# Altium project acquisition board.PRJPCB
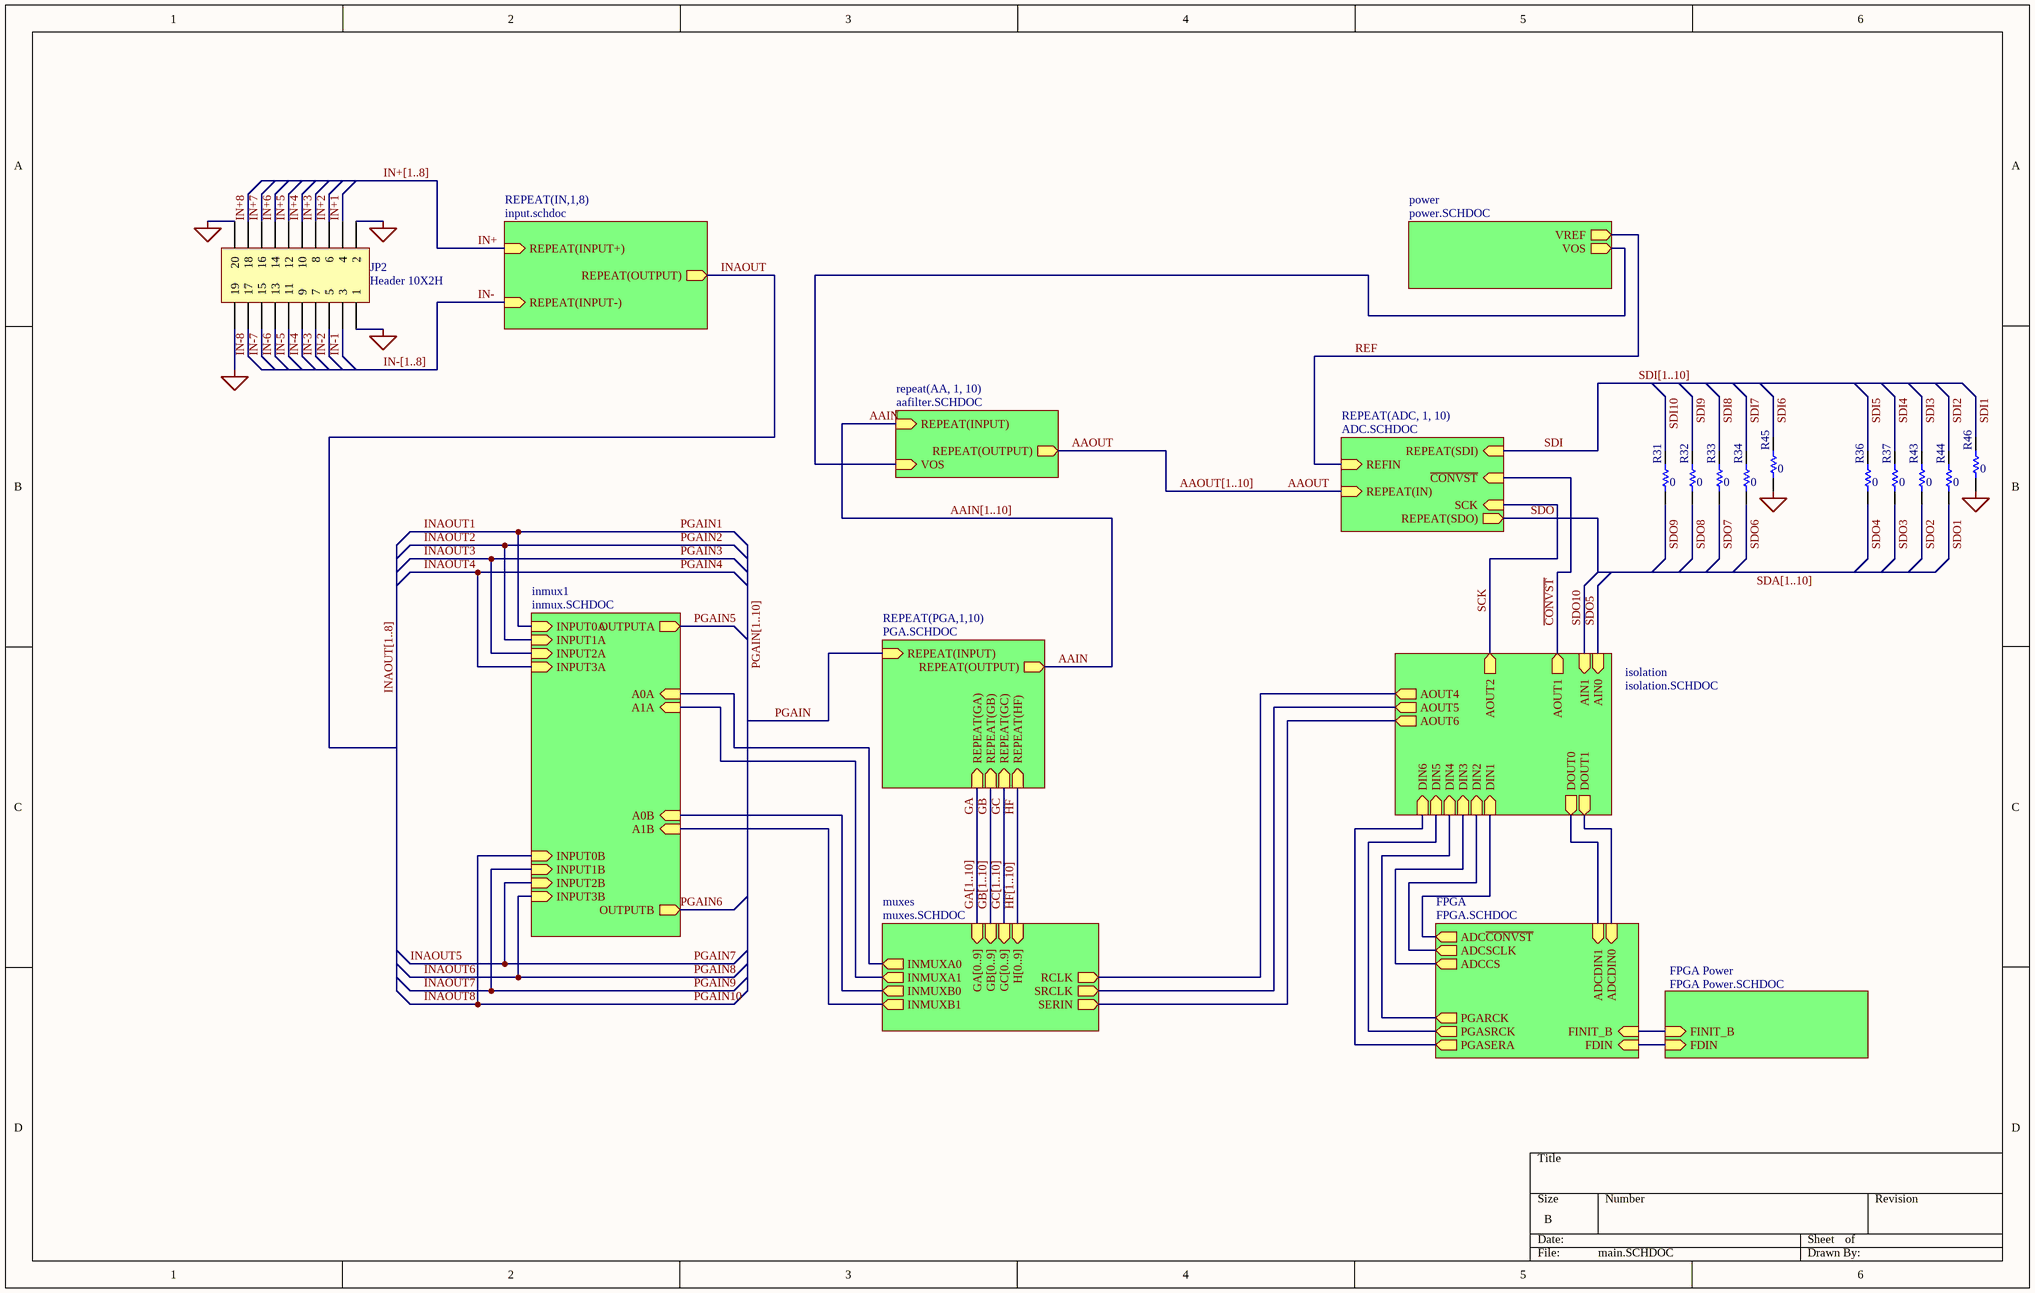
[diagram p0: main.SCHDOC]
11 sheets, 570 parts. Net scope: hierarchical (ports join the sheet entries above them; power ports are global).
Board file: acqboard.PcbDoc
Sheets:
  main.SCHDOC
    IN1 = input.SCHDOC
    IN2 = input.SCHDOC
    IN3 = input.SCHDOC
    IN4 = input.SCHDOC
    IN5 = input.SCHDOC
    IN6 = input.SCHDOC
    IN7 = input.SCHDOC
    IN8 = input.SCHDOC
    AA1 = aafilter.SCHDOC
    AA2 = aafilter.SCHDOC
    AA3 = aafilter.SCHDOC
    AA4 = aafilter.SCHDOC
    AA5 = aafilter.SCHDOC
    AA6 = aafilter.SCHDOC
    AA7 = aafilter.SCHDOC
    AA8 = aafilter.SCHDOC
    AA9 = aafilter.SCHDOC
    AA10 = aafilter.SCHDOC
    inmux1 = inmux.SCHDOC
    PGA1 = PGA.SCHDOC
    PGA2 = PGA.SCHDOC
    PGA3 = PGA.SCHDOC
    PGA4 = PGA.SCHDOC
    PGA5 = PGA.SCHDOC
    PGA6 = PGA.SCHDOC
    PGA7 = PGA.SCHDOC
    PGA8 = PGA.SCHDOC
    PGA9 = PGA.SCHDOC
    PGA10 = PGA.SCHDOC
    isolation = isolation.SCHDOC
    power = power.SCHDOC
    FPGA = FPGA.SCHDOC
    muxes = muxes.SCHDOC
    FPGA Power = FPGA Power.SCHDOC
    ADC1 = ADC.SCHDOC
    ADC2 = ADC.SCHDOC
    ADC3 = ADC.SCHDOC
    ADC4 = ADC.SCHDOC
    ADC5 = ADC.SCHDOC
    ADC6 = ADC.SCHDOC
    ADC7 = ADC.SCHDOC
    ADC8 = ADC.SCHDOC
    ADC9 = ADC.SCHDOC
    ADC10 = ADC.SCHDOC

## Sheet main.SCHDOC
size B

### Parts
JP2  Header 10X2H  [HDR2X10]
R31  value 0  [0603]  (hidden comment: Res1)
R32  value 0  [0603]  (hidden comment: Res1)
R33  value 0  [0603]  (hidden comment: Res1)
R34  value 0  [0603]  (hidden comment: Res1)
R36  value 0  [0603]  (hidden comment: Res1)
R37  value 0  [0603]  (hidden comment: Res1)
R43  value 0  [0603]  (hidden comment: Res1)
R44  value 0  [0603]  (hidden comment: Res1)
R45  value 0  [0603]  (hidden comment: Res1)
R46  value 0  [0603]  (hidden comment: Res1)

### Sub-sheets
FPGA = FPGA.SCHDOC: ADCDIN0 (in), ADCDIN1 (in), ADCSCLK (out), ADCCS (out), ADC~{CONVST} (out), PGARCK (out), PGASRCK (out), PGASERA (out), FINIT_B (in), FDIN (in)
FPGA Power = FPGA Power.SCHDOC: FINIT_B (in), FDIN (in)
inmux1 = inmux.SCHDOC: INPUT0A (in), INPUT1A (in), INPUT2A (in), INPUT3A (in), A0A (in), A1A (in), OUTPUTA (out), INPUT0B (in), INPUT1B (in), INPUT2B (in), INPUT3B, A0B (in), A1B (in), OUTPUTB (out)
isolation = isolation.SCHDOC: AIN1 (in), AIN0 (in), DOUT1 (out), DOUT0 (out), AOUT1 (out), AOUT2 (out), AOUT4, AOUT5 (out), AOUT6 (out), DIN1 (in), DIN2 (in), DIN3 (in), DIN4 (in), DIN5 (in), DIN6 (in)
muxes = muxes.SCHDOC: RCLK (out), SRCLK (out), SERIN (out), INMUXA0 (out), INMUXA1 (out), INMUXB0 (out), INMUXB1 (out), H[0..9] (in), GA[0..9] (in), GB[0..9] (in), GC[0..9] (in)
power = power.SCHDOC: VREF (out), VOS (out)
repeat(AA, 1, 10) = aafilter.SCHDOC: REPEAT(OUTPUT) (out), REPEAT(INPUT) (in), VOS (in)
REPEAT(ADC, 1, 10) = ADC.SCHDOC: REFIN (in), REPEAT(IN) (in), ~{CONVST} (in), SCK (in), REPEAT(SDO) (out), REPEAT(SDI) (in)
REPEAT(IN,1,8) = input.schdoc: REPEAT(INPUT+) (in), REPEAT(INPUT-) (in), REPEAT(OUTPUT) (out)
REPEAT(PGA,1,10) = PGA.SCHDOC: REPEAT(OUTPUT) (out), REPEAT(INPUT) (in), REPEAT(HF) (in), REPEAT(GA) (in), REPEAT(GB) (in), REPEAT(GC) (in)

### Nets
AGND: JP2.1 JP2.2 JP2.19 JP2.20 R45.1 R46.1
AAIN: sheet repeat(AA, 1, 10)/REPEAT(INPUT), sheet REPEAT(PGA,1,10)/REPEAT(OUTPUT)
AAOUT: sheet repeat(AA, 1, 10)/REPEAT(OUTPUT), sheet REPEAT(ADC, 1, 10)/REPEAT(IN)
~{CONVST}: sheet isolation/AOUT1, sheet REPEAT(ADC, 1, 10)/~{CONVST}
FDIN: sheet FPGA/FDIN, sheet FPGA Power/FDIN
FINIT_B: sheet FPGA/FINIT_B, sheet FPGA Power/FINIT_B
GA: sheet REPEAT(PGA,1,10)/REPEAT(GA)
GB: sheet REPEAT(PGA,1,10)/REPEAT(GB)
GC: sheet REPEAT(PGA,1,10)/REPEAT(GC)
HF: sheet REPEAT(PGA,1,10)/REPEAT(HF)
IN+: sheet REPEAT(IN,1,8)/REPEAT(INPUT+)
IN+1: JP2.4
IN+2: JP2.6
IN+3: JP2.8
IN+4: JP2.10
IN+5: JP2.12
IN+6: JP2.14
IN+7: JP2.16
IN+8: JP2.18
IN-: sheet REPEAT(IN,1,8)/REPEAT(INPUT-)
IN-1: JP2.3
IN-2: JP2.5
IN-3: JP2.7
IN-4: JP2.9
IN-5: JP2.11
IN-6: JP2.13
IN-7: JP2.15
IN-8: JP2.17
INAOUT: sheet REPEAT(IN,1,8)/REPEAT(OUTPUT)
PGAIN: sheet REPEAT(PGA,1,10)/REPEAT(INPUT)
RCLK: sheet isolation/AOUT4, sheet muxes/RCLK
REF: sheet power/VREF, sheet REPEAT(ADC, 1, 10)/REFIN
SCK: sheet isolation/AOUT2, sheet REPEAT(ADC, 1, 10)/SCK
SDI: sheet REPEAT(ADC, 1, 10)/REPEAT(SDI)
SDI1: R46.2
SDI2: R44.2
SDI3: R43.2
SDI4: R37.2
SDI5: R36.2
SDI6: R45.2
SDI7: R34.2
SDI8: R33.2
SDI9: R32.2
SDI10: R31.2
SDO: sheet REPEAT(ADC, 1, 10)/REPEAT(SDO)
SDO1: R44.1
SDO2: R43.1
SDO3: R37.1
SDO4: R36.1
SDO6: R34.1
SDO7: R33.1
SDO8: R32.1
SDO9: R31.1
SRCLK: sheet isolation/AOUT5, sheet muxes/SRCLK
NetU4_1: sheet isolation/DIN6, sheet FPGA/PGASERA
NetU4_2: sheet isolation/DIN5, sheet FPGA/PGASRCK
NetU4_5: sheet isolation/DIN4, sheet FPGA/PGARCK
NetU4_9: sheet isolation/DIN3, sheet FPGA/ADCCS
NetU4_71: sheet isolation/DOUT0, sheet FPGA/ADCDIN1
NetU4_72: sheet isolation/DOUT1, sheet FPGA/ADCDIN0
NetU4_89: sheet isolation/DIN1, sheet FPGA/ADC~{CONVST}
NetU4_91: sheet isolation/DIN2, sheet FPGA/ADCSCLK
NetU10.1_5: sheet repeat(AA, 1, 10)/VOS, sheet power/VOS
Netu11_1: sheet inmux1/A0A, sheet muxes/INMUXA0
Netu11_14: sheet inmux1/A1A, sheet muxes/INMUXA1
NetU14_11: sheet isolation/AOUT6, sheet muxes/SERIN
NetU21_4: sheet inmux1/A0B, sheet muxes/INMUXB0
NetU21_5: sheet inmux1/A1B, sheet muxes/INMUXB1

### Buses and harness runs
bus AAIN[1..10]
bus AAOUT[1..10]
bus GA[1..10] = sheet muxes/GA[0..9]
bus GB[1..10] = sheet muxes/GB[0..9]
bus GC[1..10] = sheet muxes/GC[0..9]
bus HF[1..10] = sheet muxes/H[0..9]
bus IN+[1..8]
bus IN-[1..8]
bus INAOUT[1..8]
bus PGAIN[1..10]
bus SDA[1..10]
bus SDI[1..10]

### Library data of the parts
JP2 = Header 10X2H: Header, 10-Pin, Dual row, Right Angle; Manufacturer: Generic Components; Class I: Connector; Revision: July-2002: Re-released for DXP Platform.; Publisher: Altium Limited
R31-R34 R36 R37 R43-R46 = Res1: Resistor; Published: 8-Jun-2000; LatestRevisionDate: 17-Jul-2002; LatestRevisionNote: Re-released for DXP Platform.; Publisher: Altium Limited

## Sheet input.SCHDOC
size B
Used 8 times, as channels IN1, IN2, IN3, IN4, IN5, IN6, IN7, IN8. Parts and nets are listed once, with the designators drawn on the sheet.
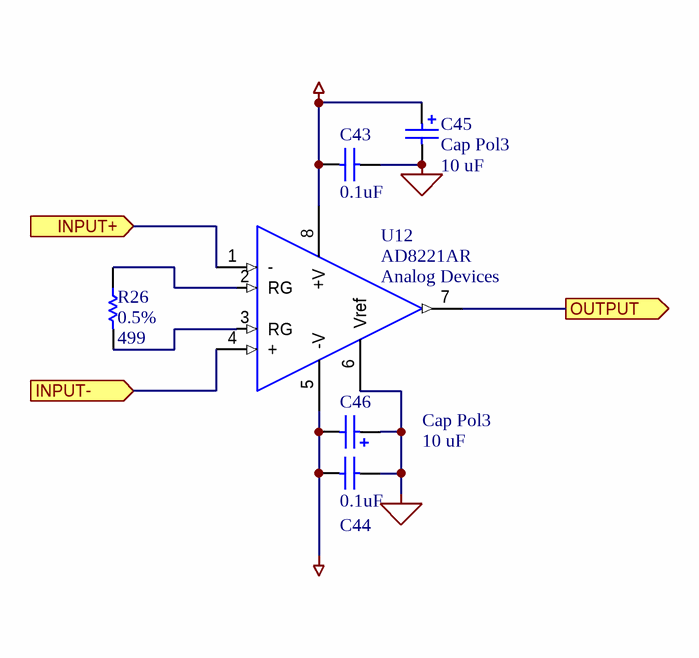
[diagram p1: input.SCHDOC]

### Parts
C43  value 0.1uF  [CC1608-0603]  (hidden comment: Cap)
C44  value 0.1uF  [CC1608-0603]  (hidden comment: Cap)
C45  Cap Pol3  value 10 uF  [TC3216-1206]
C46  Cap Pol3  value 10 uF  [TC3216-1206]
R26  0.5%  value 499  [CC1608-0603]
U12  AD8221AR  Vendor: Analog Devices  [SO-G8]

### Ports
INPUT+ (in), INPUT- (in), OUTPUT (out)

### Nets
AGND: C43.2 C44.2 C45.2 C46.1 U12.6(Vref)
AVDD: C43.1 C45.1 U12.8(+V)
AVSS: C44.1 C46.2 U12.5(-V)
INPUT+: U12.1(-) ; port INPUT+
INPUT-: U12.4(+) ; port INPUT-
OUTPUT: U12.7(Vout) ; port OUTPUT
NetR26_1: R26.1 U12.2(RG)
NetR26_2: R26.2 U12.3(RG)

### Channels
IN1: designators end in .1; ports INPUT+=IN+1 INPUT-=IN-1 OUTPUT=INAOUT1
IN2: designators end in .2; ports INPUT+=IN+2 INPUT-=IN-2 OUTPUT=INAOUT2
IN3: designators end in .3; ports INPUT+=IN+3 INPUT-=IN-3 OUTPUT=INAOUT3
IN4: designators end in .4; ports INPUT+=IN+4 INPUT-=IN-4 OUTPUT=INAOUT4
IN5: designators end in .5; ports INPUT+=IN+5 INPUT-=IN-5 OUTPUT=INAOUT5
IN6: designators end in .6; ports INPUT+=IN+6 INPUT-=IN-6 OUTPUT=INAOUT6
IN7: designators end in .7; ports INPUT+=IN+7 INPUT-=IN-7 OUTPUT=INAOUT7
IN8: designators end in .8; ports INPUT+=IN+8 INPUT-=IN-8 OUTPUT=INAOUT8

### Library data of the parts
C43 C44 = Cap: Capacitor; Manufacturer: Generic Components; Class I: Passive; Published: 8-Jun-2000; Revision: July-2002: Re-released for DXP Platform.; Publisher: Altium Limited; Class II: Capacitor
C45 C46 = Cap Pol3: Polarized Capacitor (Surface Mount); Manufacturer: Generic Components; Class I: Passive; Published: 8-Jun-2000; Revision: July-2002: Re-released for DXP Platform.; Publisher: Altium Limited; Class II: Capacitor
R26 = Res1: RR1220P-4990-D-M; Manufacturer: Generic Components; Class I: Passive; Class II: Resistor; Published: 8-Jun-2000; Revision: July-2002: Re-released for DXP Platform.; Publisher: Altium Limited
U12 = AD8221: AD8221 Precision Instrumentation Amplifier

## Sheet aafilter.SCHDOC
size B
Used 10 times, as channels AA1, AA2, AA3, AA4, AA5, AA6, AA7, AA8, AA9, AA10. Parts and nets are listed once, with the designators drawn on the sheet.
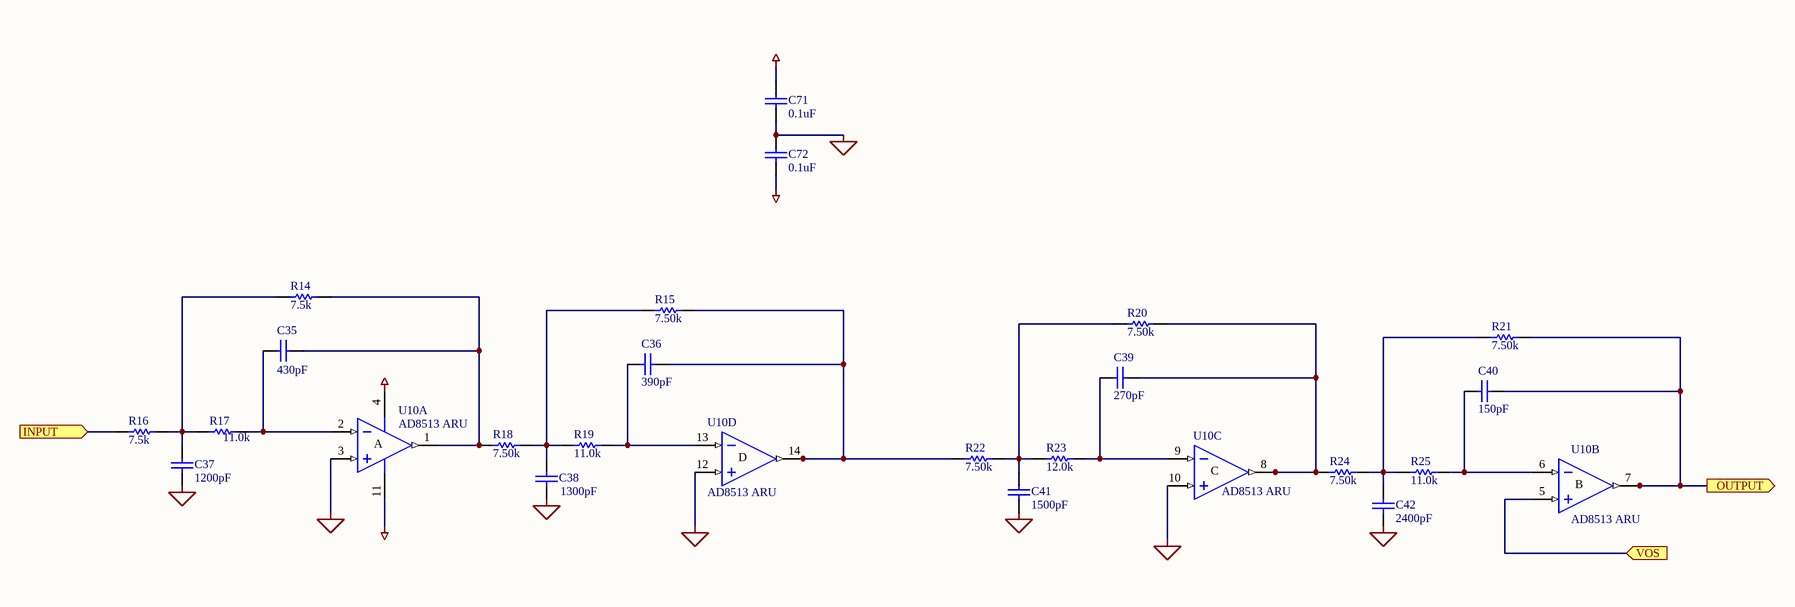
[diagram p2: aafilter.SCHDOC]

### Parts
C35  value 430pF  [CC1608-0603]  (hidden comment: Cap)
C36  value 390pF  [CC1608-0603]  (hidden comment: Cap)
C37  value 1200pF  [CC1608-0603]  (hidden comment: Cap)
C38  value 1300pF  [CC1608-0603]  (hidden comment: Cap)
C39  value 270pF  [CC1608-0603]  (hidden comment: Cap)
C40  value 150pF  [CC1608-0603]  (hidden comment: Cap)
C41  value 1500pF  [CC1608-0603]  (hidden comment: Cap)
C42  value 2400pF  [CC1608-0603]  (hidden comment: Cap)
C71  value 0.1uF  [CC1608-0603]  (hidden comment: Cap)
C72  value 0.1uF  [CC1608-0603]  (hidden comment: Cap)
R14  value 7.5k  [CC1608-0603]  (hidden comment: Res1)
R15  value 7.50k  [CC1608-0603]  (hidden comment: Res1)
R16  value 7.5k  [CC1608-0603]  (hidden comment: Res1)
R17  value 11.0k  [CC1608-0603]  (hidden comment: Res1)
R18  value 7.50k  [CC1608-0603]  (hidden comment: Res1)
R19  value 11.0k  [CC1608-0603]  (hidden comment: Res1)
R20  value 7.50k  [CC1608-0603]  (hidden comment: Res1)
R21  value 7.50k  [CC1608-0603]  (hidden comment: Res1)
R22  value 7.50k  [CC1608-0603]  (hidden comment: Res1)
R23  value 12.0k  [CC1608-0603]  (hidden comment: Res1)
R24  value 7.50k  [CC1608-0603]  (hidden comment: Res1)
R25  value 11.0k  [CC1608-0603]  (hidden comment: Res1)
U10  AD8513 ARU  [SO-G14]  (parts A,B,C,D of 4)

### Ports
INPUT (in), OUTPUT (out), VOS (in)

### Nets
AGND: C37.1 C38.1 C41.1 C42.1 C71.1 C72.2 U10.3(IN+A) U10.10(IN+C) U10.12(IN+D)
AVDD: C71.2 U10.4(V+)
AVSS: C72.1 U10.11(V-)
INPUT: R16.1 ; port INPUT
OUTPUT: C40.1 R21.1 U10.7(OUTB) ; port OUTPUT
VOS: U10.5(IN+B) ; port VOS
NetC35_1: C35.1 R14.1 R18.1 U10.1(OUTA)
NetC35_2: C35.2 R17.2 U10.2(IN-A)
NetC36_1: C36.1 R15.1 R22.1 U10.14(OUTD)
NetC36_2: C36.2 R19.2 U10.13(IN-D)
NetC37_2: C37.2 R14.2 R16.2 R17.1
NetC38_2: C38.2 R15.2 R18.2 R19.1
NetC39_1: C39.1 R20.1 R24.1 U10.8(OUTC)
NetC39_2: C39.2 R23.2 U10.9(IN-C)
NetC40_2: C40.2 R25.2 U10.6(IN-B)
NetC41_2: C41.2 R20.2 R22.2 R23.1
NetC42_2: C42.2 R21.2 R24.2 R25.1

### Channels
AA1: designators end in .1; ports INPUT=AAIN1 OUTPUT=AAOUT1 VOS=NetU10.1_5
AA2: designators end in .2; ports INPUT=AAIN2 OUTPUT=AAOUT2 VOS=NetU10.1_5
AA3: designators end in .3; ports INPUT=AAIN3 OUTPUT=AAOUT3 VOS=NetU10.1_5
AA4: designators end in .4; ports INPUT=AAIN4 OUTPUT=AAOUT4 VOS=NetU10.1_5
AA5: designators end in .5; ports INPUT=AAIN5 OUTPUT=AAOUT5 VOS=NetU10.1_5
AA6: designators end in .6; ports INPUT=AAIN6 OUTPUT=AAOUT6 VOS=NetU10.1_5
AA7: designators end in .7; ports INPUT=AAIN7 OUTPUT=AAOUT7 VOS=NetU10.1_5
AA8: designators end in .8; ports INPUT=AAIN8 OUTPUT=AAOUT8 VOS=NetU10.1_5
AA9: designators end in .9; ports INPUT=AAIN9 OUTPUT=AAOUT9 VOS=NetU10.1_5
AA10: designators end in .10; ports INPUT=AAIN10 OUTPUT=AAOUT10 VOS=NetU10.1_5

### Notes on the sheet
- (in symbol AD8513ARU, part A) A
- (in symbol AD8513ARU, part B) B
- (in symbol AD8513ARU, part C) C
- (in symbol AD8513ARU, part D) D

### Library data of the parts
C35-C42 C71 C72 = Cap: as C43 on sheet input; Published: 8-Jun-2000; Revision: July-2002: Re-released for DXP Platform.; Publisher: Altium Limited; Class II: Capacitor
R14-R25 = Res1: Resistor; Manufacturer: Generic Components; Class I: Passive; Published: 8-Jun-2000; Revision: July-2002: Re-released for DXP Platform.; Publisher: Altium Limited; Class II: Resistor
U10 = AD8513ARU: low-noise JFET quad OA; Vendor: Analog Devices

## Sheet inmux.SCHDOC
size A
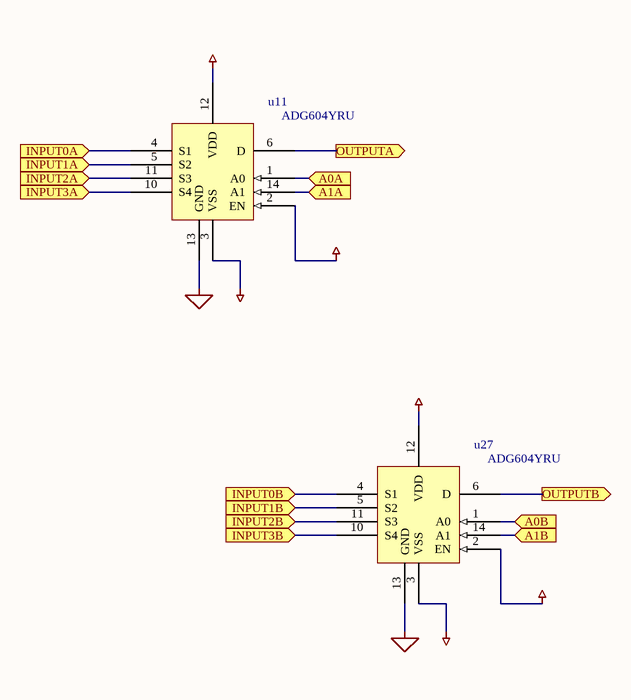
[diagram p3: inmux.SCHDOC]

### Parts
u11  ADG604YRU  [SSO-G14/X.4]
u27  ADG604YRU  [SSO-G14/X.4]

### Ports
A0A (in), A0B (in), A1A (in), A1B (in), INPUT0A (in), INPUT0B (in), INPUT1A (in), INPUT1B (in), INPUT2A (in), INPUT2B (in), INPUT3A (in), INPUT3B (in), OUTPUTA (out), OUTPUTB (out)

### Nets
AGND: u11.13(GND) u27.13(GND)
AVDD: u11.2(EN) u11.12(VDD) u27.2(EN) u27.12(VDD)
AVSS: u11.3(VSS) u27.3(VSS)
INAOUT1: u11.4(S1) ; port INPUT0A
INAOUT2: u11.5(S2) ; port INPUT1A
INAOUT3: u11.11(S3) ; port INPUT2A
INAOUT4: u11.10(S4) ; port INPUT3A
INAOUT5: u27.11(S3) ; port INPUT2B
INAOUT6: u27.10(S4) ; port INPUT3B
INAOUT7: u27.5(S2) ; port INPUT1B
INAOUT8: u27.4(S1) ; port INPUT0B
PGAIN5: u11.6(D) ; port OUTPUTA
PGAIN6: u27.6(D) ; port OUTPUTB
Netu11_1: u11.1(A0) ; port A0A
Netu11_14: u11.14(A1) ; port A1A
NetU21_4: u27.1(A0) ; port A0B
NetU21_5: u27.14(A1) ; port A1B

### Library data of the parts
u11 u27 = ADG604: 1 pC Charge Injection 100pA leakage CMOS 4-channel mux

## Sheet PGA.SCHDOC
size B
Used 10 times, as channels PGA1, PGA2, PGA3, PGA4, PGA5, PGA6, PGA7, PGA8, PGA9, PGA10. Parts and nets are listed once, with the designators drawn on the sheet.
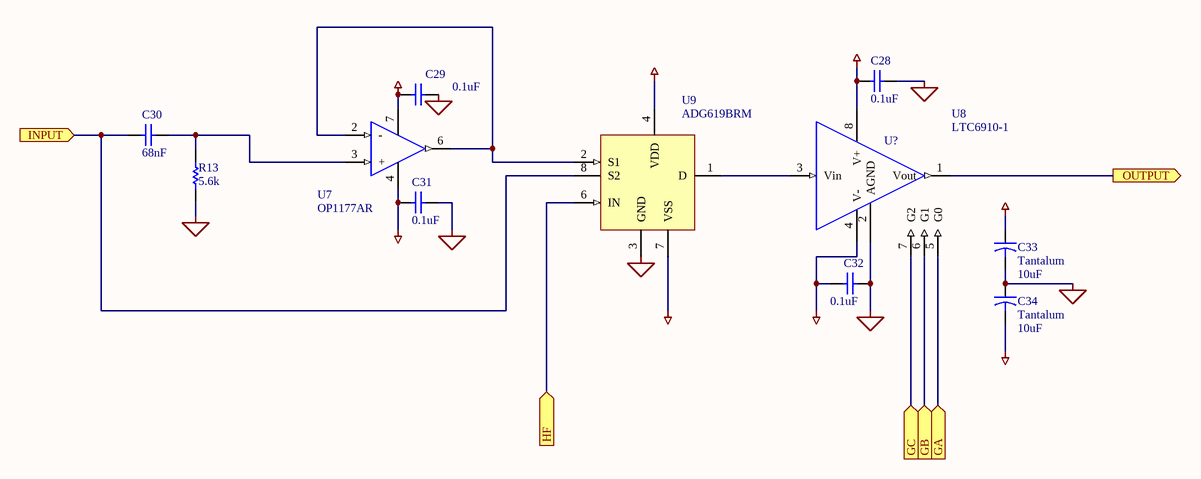
[diagram p4: PGA.SCHDOC]

### Parts
C28  value 0.1uF  [CC1608-0603]  (hidden comment: Cap)
C29  value 0.1uF  [CC1608-0603]  (hidden comment: Cap)
C30  value 68nF  [CC1608-0603]  (hidden comment: Cap)
C31  value 0.1uF  [CC1608-0603]  (hidden comment: Cap)
C32  value 0.1uF  [CC1608-0603]  (hidden comment: Cap)
C33  Tantalum  value 10uF  [TC3216-1206]
C34  Tantalum  value 10uF  [TC3216-1206]
R13  value 5.6k  [CC1608-0603]  (hidden comment: Res1)
U7  OP1177AR  [TSSO3X5-G8/X.4]
U8  LTC6910-1  [TSOT-23-8]
U9  ADG619BRM  [MSOP8]

### Ports
GA (in), GB (in), GC (in), HF (in), INPUT (in), OUTPUT (out)

### Nets
AGND: C28.2 C29.2 C31.2 C32.1 C33.2 C34.1 R13.1 U8.2(AGND) U9.3(GND)
AVDD: C28.1 C29.1 C33.1 U7.7(+Vs) U8.8(V+) U9.4(VDD)
AVSS: C31.1 C32.2 C34.2 U7.4(-Vs) U8.4(V-) U9.7(VSS)
GA: U8.5(G0) ; port GA
GB: U8.6(G1) ; port GB
GC: U8.7(G2) ; port GC
HF: U9.6(IN) ; port HF
INPUT: C30.2 U9.8(S2) ; port INPUT
OUTPUT: U8.1(Vout) ; port OUTPUT
NetC30_1: C30.1 R13.2 U7.3(+)
NetU7_2: U7.2(-) U7.6(Out) U9.2(S1)
NetU8_3: U8.3(Vin) U9.1(D)

### Channels
PGA1: designators end in .1; ports GA=GA0 GB=GB0 GC=GC0 HF=H0 INPUT=INAOUT1 OUTPUT=AAIN1
PGA2: designators end in .2; ports GA=GA1 GB=GB1 GC=GC1 HF=H1 INPUT=INAOUT2 OUTPUT=AAIN2
PGA3: designators end in .3; ports GA=GA2 GB=GB2 GC=GC2 HF=H2 INPUT=INAOUT3 OUTPUT=AAIN3
PGA4: designators end in .4; ports GA=GA3 GB=GB3 GC=GC3 HF=H3 INPUT=INAOUT4 OUTPUT=AAIN4
PGA5: designators end in .5; ports GA=GA4 GB=GB4 GC=GC4 HF=H4 INPUT=PGAIN5 OUTPUT=AAIN5
PGA6: designators end in .6; ports GA=GA5 GB=GB5 GC=GC5 HF=H5 INPUT=PGAIN6 OUTPUT=AAIN6
PGA7: designators end in .7; ports GA=GA6 GB=GB6 GC=GC6 HF=H6 INPUT=INAOUT5 OUTPUT=AAIN7
PGA8: designators end in .8; ports GA=GA7 GB=GB7 GC=GC7 HF=H7 INPUT=INAOUT6 OUTPUT=AAIN8
PGA9: designators end in .9; ports GA=GA8 GB=GB8 GC=GC8 HF=H8 INPUT=INAOUT7 OUTPUT=AAIN9
PGA10: designators end in .10; ports GA=GA10 GB=GB10 GC=GC10 HF=H9 INPUT=INAOUT8 OUTPUT=AAIN10

### Notes on the sheet
- (in symbol LTC6910-1) U?

### Library data of the parts
C28-C32 = Cap: as C43 on sheet input; Published: 8-Jun-2000; Revision: July-2002: Re-released for DXP Platform.; Publisher: Altium Limited; Class II: Capacitor
C33 C34 = Cap2: Capacitor; Manufacturer: Generic Components; Class I: Passive; Published: 23-Sep-2002; Publisher: Altium Limited; Class II: Capacitor
R13 = Res1: as R14 on sheet aafilter; Published: 8-Jun-2000; Revision: July-2002: Re-released for DXP Platform.; Publisher: Altium Limited; Class II: Resistor
U7 = OP1177: Precision Low Noise, Low Input Bias Current Operational Amplifier; Vendor: Analog Devices
U8 = LTC6910-1: LTI Digitally Controlled Programmabe Gain Amp; Vendor: Linear Technology
U9 = ADG619: Low RON SPDT Switch (s2 normally on); Vendors: Analog Devices

## Sheet isolation.SCHDOC
size B
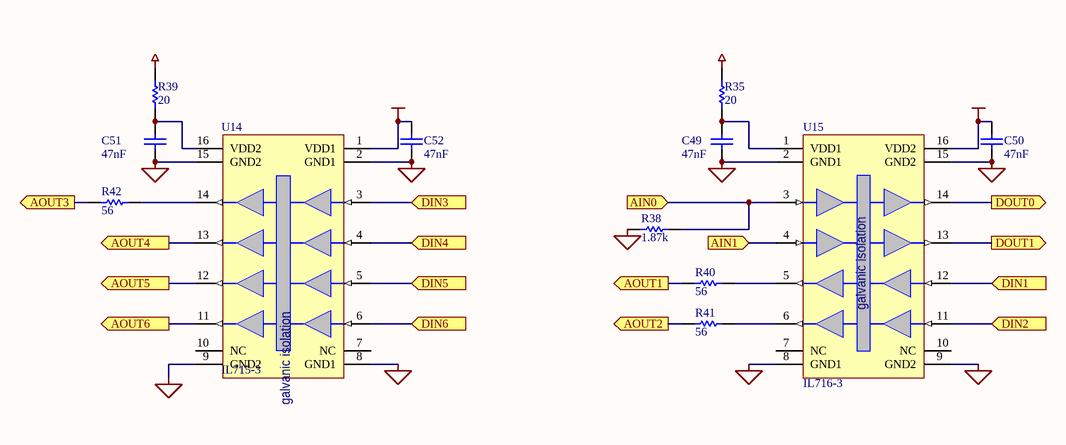
[diagram p5: isolation.SCHDOC]

### Parts
C49  value 47nF  [CC1608-0603]  (hidden comment: Cap)
C50  value 47nF  [CC1608-0603]  (hidden comment: Cap)
C51  value 47nF  [CC1608-0603]  (hidden comment: Cap)
C52  value 47nF  [CC1608-0603]  (hidden comment: Cap)
R35  value 20  [CC1608-0603]  (hidden comment: Res1)
R38  value 1.87k  [CC1608-0603]  (hidden comment: Res1)
R39  value 20  [CC1608-0603]  (hidden comment: Res1)
R40  value 56  [CC1608-0603]  (hidden comment: Res1)
R41  value 56  [CC1608-0603]  (hidden comment: Res1)
R42  value 56  [CC1608-0603]  (hidden comment: Res1)
U14  IL715-3  [SO-G16/D10]
U15  IL716-3  [SO-G16/D10]

### Ports
AIN0 (in), AIN1 (in), AOUT1 (out), AOUT2 (out), AOUT3 (out), AOUT4 (out), AOUT5 (out), AOUT6 (out), DIN1 (in), DIN2 (in), DIN3 (in), DIN4 (in), DIN5 (in), DIN6 (in), DOUT0 (out), DOUT1 (out)

### Nets
AGND: C49.1 C51.1 R38.1 U14.9(GND2) U14.15(GND2) U15.2(GND1) U15.8(GND1)
AVDD: R35.2 R39.2
GND: C50.1 C52.1 U14.2(GND1) U14.8(GND1) U15.9(GND2) U15.15(GND2)
VCC: C50.2 C52.2 U14.1(VDD1) U15.16(VDD2)
~{CONVST}: R40.1 ; port AOUT1
RCLK: U14.13(OUT2) ; port AOUT4
SCK: R41.1 ; port AOUT2
SDO5: R38.2 U15.3(IN1) ; port AIN0
SDO10: U15.4(IN2) ; port AIN1
SRCLK: U14.12(OUT3) ; port AOUT5
NetC49_2: C49.2 R35.1 U15.1(VDD1)
NetC51_2: C51.2 R39.1 U14.16(VDD2)
NetR40_2: R40.2 U15.5(OUT3)
NetR41_2: R41.2 U15.6(OUT4)
NetR42_1: R42.1 ; port AOUT3
NetR42_2: R42.2 U14.14(OUT1)
NetU4_1: U14.6(IN4) ; port DIN6
NetU4_2: U14.5(IN3) ; port DIN5
NetU4_5: U14.4(IN2) ; port DIN4
NetU4_9: U14.3(IN1) ; port DIN3
NetU4_71: U15.14(OUT1) ; port DOUT0
NetU4_72: U15.13(OUT2) ; port DOUT1
NetU4_89: U15.12(IN3) ; port DIN1
NetU4_91: U15.11(IN4) ; port DIN2
NetU14_11: U14.11(OUT4) ; port AOUT6

Not connected (* = marked no-connect by the designer): U14 7(NC) 10(NC); U15 7(NC) 10(NC)

### Notes on the sheet
- (in symbol IL715-3) galvanic isolation
- (in symbol IL716-3) galvanic isolation

### Library data of the parts
C49-C52 = Cap: as C43 on sheet input; Published: 8-Jun-2000; Revision: July-2002: Re-released for DXP Platform.; Publisher: Altium Limited; Class II: Capacitor
R35 R38-R42 = Res1: as R14 on sheet aafilter; Published: 8-Jun-2000; Revision: July-2002: Re-released for DXP Platform.; Publisher: Altium Limited; Class II: Resistor
U14 = IL715-3: High speed digital coupler; Vendor: NVE Corp/Isolation Products
U15 = IL716-3: High speed digital coupler; Vendor: NVE Corp/Isolation Products

## Sheet power.SCHDOC
size A
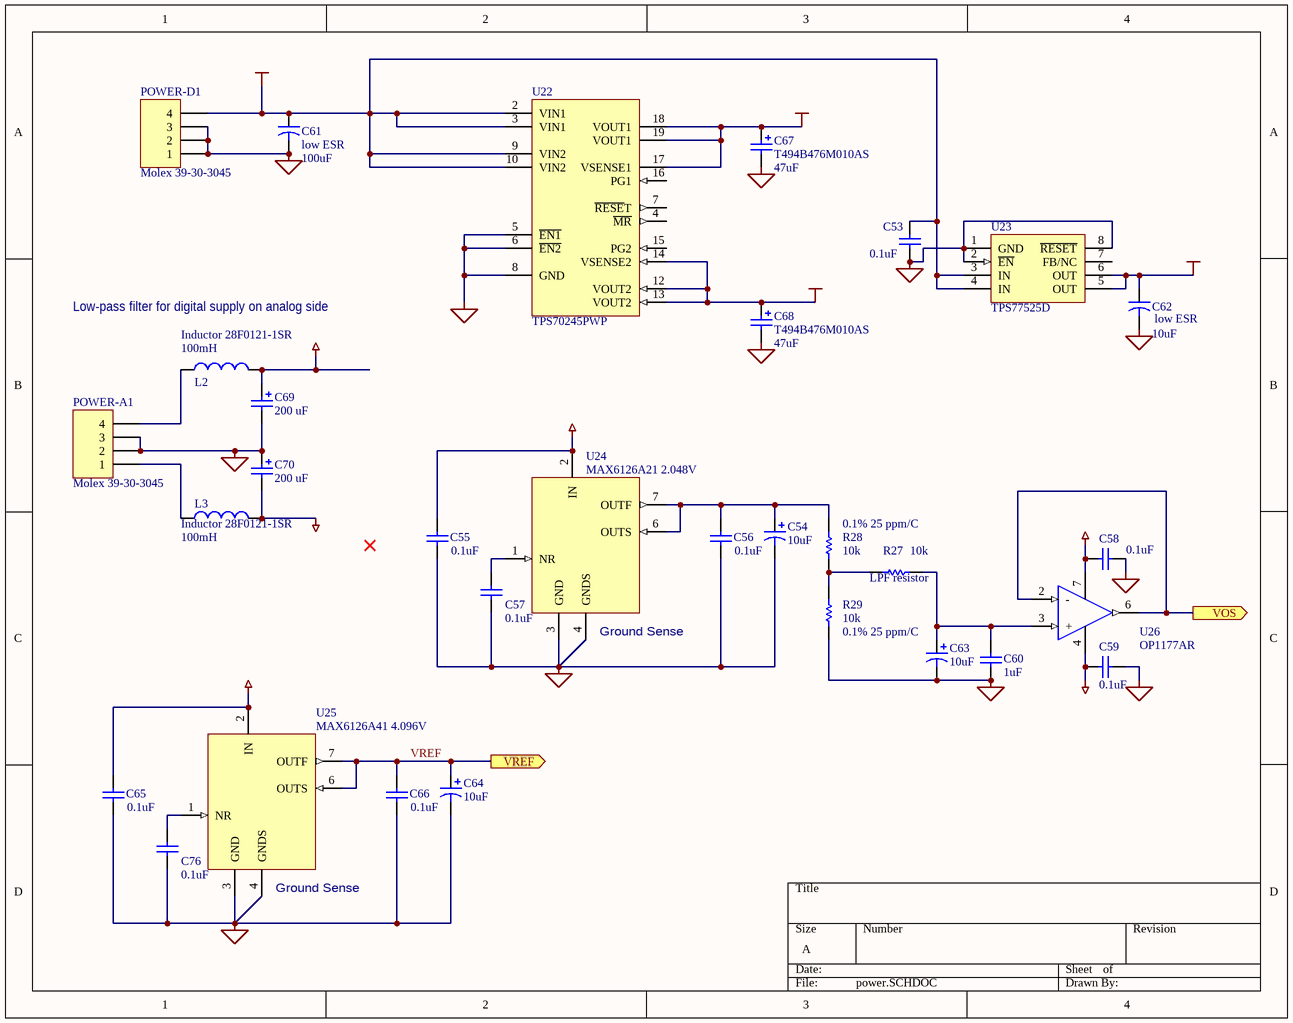
[diagram p6: power.SCHDOC]

### Parts
C53  value 0.1uF  [CC1608-0603]  (hidden comment: Cap)
C54  value 10uF  [TC3528-1411]  (hidden comment: Cap Pol1)
C55  value 0.1uF  [CC1608-0603]  (hidden comment: Cap)
C56  value 0.1uF  [CC1608-0603]  (hidden comment: Cap)
C57  value 0.1uF  [CC1608-0603]  (hidden comment: Cap)
C58  value 0.1uF  [CC1608-0603]  (hidden comment: Cap)
C59  value 0.1uF  [CC1608-0603]  (hidden comment: Cap)
C60  value 1uF  [CC1608-0603]  (hidden comment: Cap)
C61  low ESR  value 100uF  [PanasonicE]
C62  low ESR  value 10uF  [TC3528-1411]
C63  value 10uF  [TC3528-1411]  (hidden comment: Cap Pol1)
C64  value 10uF  [TC3528-1411]  (hidden comment: Cap Pol1)
C65  value 0.1uF  [CC1608-0603]  (hidden comment: Cap)
C66  value 0.1uF  [CC1608-0603]  (hidden comment: Cap)
C67  T494B476M010AS  value 47uF  [TC3528-1411]
C68  T494B476M010AS  value 47uF  [TC3528-1411]
C69  value 200 uF  [PanasonicE]
C70  value 200 uF  [PanasonicE]
C76  value 0.1uF  [CC1608-0603]  (hidden comment: Cap)
L2  Inductor 28F0121-1SR  value 100mH  [STEWARD_1SR]
L3  Inductor 28F0121-1SR  value 100mH  [STEWARD_1SR]
POWER-A1  Molex 39-30-3045  [MJ4RTHR]
POWER-D1  Molex 39-30-3045  [MJ4RTHR]
R27  LPF resistor  value 10k  [CC1608-0603]
R28  0.1% 25 ppm/C  value 10k  [CC1608-0603]
R29  0.1% 25 ppm/C  value 10k  [CC1608-0603]
U22  TPS70245PWP  [PWP PowerPad -20]
U23  TPS77525D  [SO-G8]
U24  MAX6126A21 2.048V  [TSSO3x5-G8/X.35]
U25  MAX6126A41 4.096V  [TSSO3x5-G8/X.35]
U26  OP1177AR  [TSSO3X5-G8/X.4]

### Ports
VOS (out), VREF (out)

### Nets
+1.2VCC: C68.1 U22.12(VOUT2) U22.13(VOUT2) U22.14(VSENSE2)
+2.5VCC: C62.1 U23.5(OUT) U23.6(OUT)
+5VCC: C53.1 C61.1 POWER-D1.4 U22.2(VIN1) U22.3(VIN1) U22.9(VIN2) U22.10(VIN2) U23.3(IN) U23.4(IN)
AGND: C54.2 C55.2 C56.2 C57.2 C58.1 C59.1 C60.2 C63.2 C64.2 C65.2 C66.2 C69.2 C70.1 C76.2 POWER-A1.2 POWER-A1.3 R29.1 U24.3(GND) U24.4(GNDS) U25.3(GND) U25.4(GNDS)
AVDD: C55.1 C58.2 C65.1 C69.1 L2.2 U24.2(IN) U25.2(IN) U26.7(+Vs)
AVSS: C59.2 C70.2 L3.2 U26.4(-Vs)
GND: C53.2 C61.2 C62.2 C67.2 C68.2 POWER-D1.1 POWER-D1.2 POWER-D1.3 U22.5(~{EN1}) U22.6(~{EN2}) U22.8(GND) U22.P1 U22.P2 U22.P3 U22.P4 U22.P5 U22.P6 U22.P7 U22.P8 U22.P9 U22.P10 U22.P11 U22.P12 U22.P13 U22.P14 U22.P15 U22.P16 U22.P17 U23.1(GND) U23.2(~{EN}) U23.8(~{RESET})
VCC: C67.1 U22.17(VSENSE1) U22.18(VOUT1) U22.19(VOUT1)
VREF: C64.1 C66.1 U25.6(OUTS) U25.7(OUTF) ; port VREF  [project net REF]
NetC54_1: C54.1 C56.1 R28.2 U24.6(OUTS) U24.7(OUTF)
NetC57_1: C57.1 U24.1(NR)
NetC60_1: C60.1 C63.1 R27.1 U26.3(+)
NetC76_1: C76.1 U25.1(NR)
NetL2_1: L2.1 POWER-A1.4
NetL3_1: L3.1 POWER-A1.1
NetR27_2: R27.2 R28.1 R29.2
NetU10.1_5: U26.2(-) U26.6(Out) ; port VOS

Not connected (* = marked no-connect by the designer): U22 4(~{MR}) 7(~{RESE}T) 15(PG2) 16(PG1); U23 7(FB/NC)

### Notes on the sheet
- Low-pass filter for digital supply on analog side
- (near U24) Ground Sense
- (near U25) Ground Sense

### Library data of the parts
C53 C55-C60 C65 C66 C76 = Cap: as C43 on sheet input; Published: 8-Jun-2000; Revision: July-2002: Re-released for DXP Platform.; Publisher: Altium Limited; Class II: Capacitor
C54 C63 C64 = Cap Pol1: Polarized Capacitor (Radial); Published: 8-Jun-2000; LatestRevisionDate: 17-Jul-2002; LatestRevisionNote: Re-released for DXP Platform.; Publisher: Altium Limited
C61 C62 = Cap2: as C33 on sheet PGA; Published: 23-Sep-2002; Publisher: Altium Limited; Class II: Capacitor
C67 C68 = Cap Pol1: Polarized Capacitor (Radial); Manufacturer: Generic Components; Class I: Passive; Published: 8-Jun-2000; Revision: July-2002: Re-released for DXP Platform.; Publisher: Altium Limited; Class II: Capacitor
C69 C70 = Cap Pol3: as C45 on sheet input; Published: 8-Jun-2000; Revision: July-2002: Re-released for DXP Platform.; Publisher: Altium Limited; Class II: Capacitor
L2 L3 = Inductor: Manufacturer: Generic Components; Class I: Passive; Published: 8-Jun-2000; Revision: July-2002: Re-released for DXP Platform.; Publisher: Altium Limited; Class II: Inductor
POWER-A1 POWER-D1 = Header 4: Header, 4-Pin; Manufacturer: Generic Components; Class I: Connector; Revision: July-2002: Re-released for DXP Platform.; Publisher: Altium Limited
R27-R29 = Res1: as R14 on sheet aafilter; Published: 8-Jun-2000; Revision: July-2002: Re-released for DXP Platform.; Publisher: Altium Limited; Class II: Resistor
U22 = TPS70245PWP: TI dual-output low dropout voltage regulators; Vendor: Texas Instruments
U23 = TPS77525D: Fast-transient-response 500 mA low-dropout voltage regulator; Vendor: Texas Instruments
U24 U25 = MAX6126A21: Ultra-High-Precision, Ultra-Low-Noise, Series Voltage Reference; Vendor: Maxim Integrated Products
U26 = OP1177: as U7 on sheet PGA

## Sheet FPGA.SCHDOC
size B
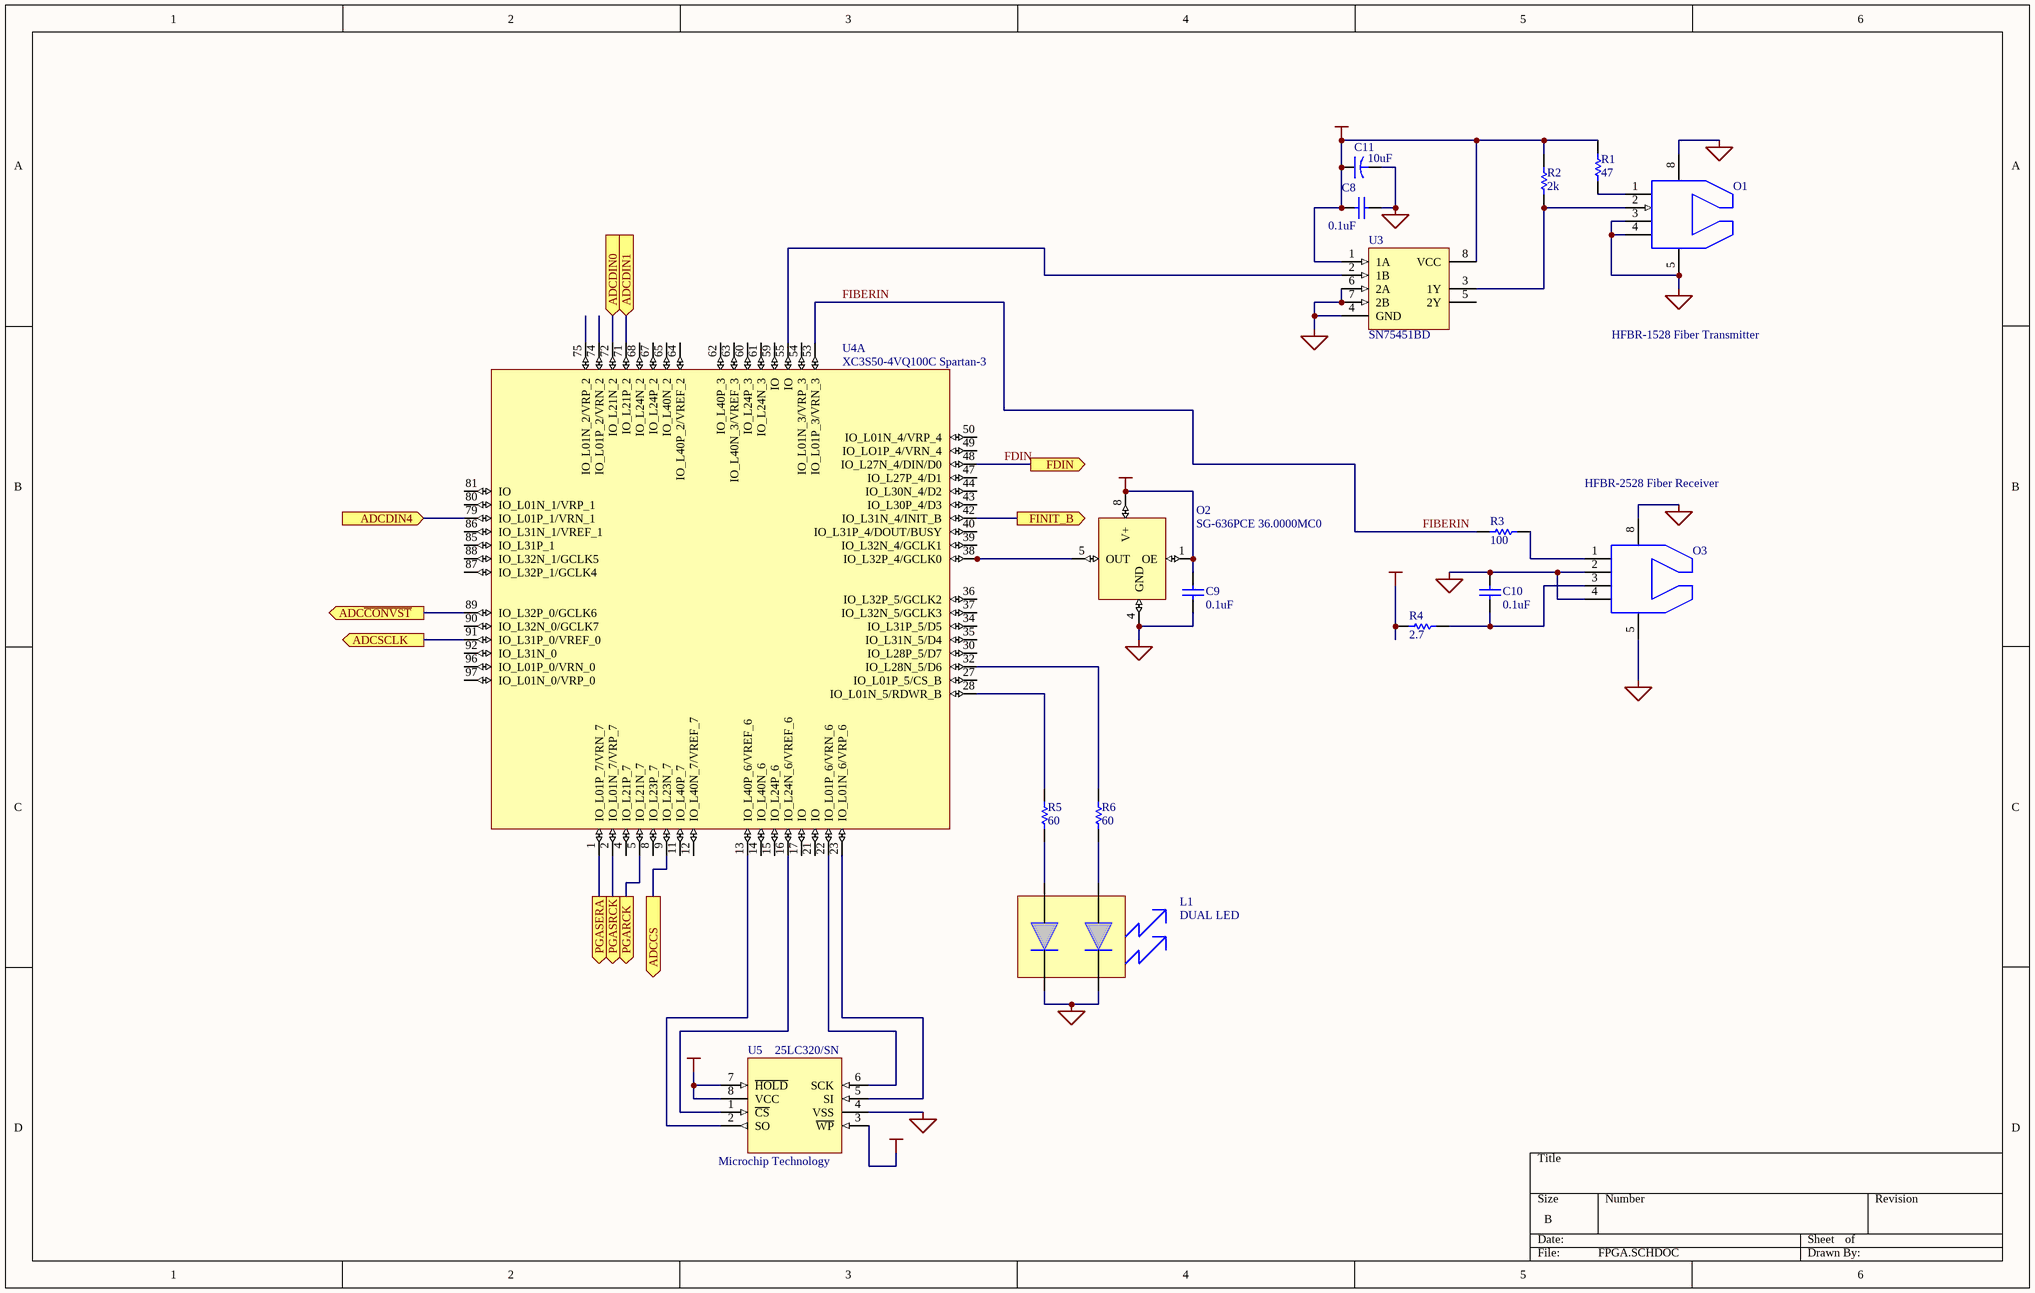
[diagram p7: FPGA.SCHDOC]

### Parts
C8  value 0.1uF  [CC1608-0603]  (hidden comment: Cap)
C9  value 0.1uF  [CC1608-0603]  (hidden comment: Cap)
C10  value 0.1uF  [CC1608-0603]  (hidden comment: Cap)
C11  value 10uF  [TC3528-1411]
L1  DUAL LED  [LUMEX DUAL RT-ANG LED]
O1  HFBR-1528 Fiber Transmitter  [HPVL]
O2  SG-636PCE 36.0000MC0  [SG636PCE]
O3  HFBR-2528 Fiber Receiver  [HPVL]
R1  value 47  [CC1608-0603]  (hidden comment: Res1)
R2  value 2k  [CC1608-0603]  (hidden comment: Res1)
R3  value 100  [CC1608-0603]  (hidden comment: Res1)
R4  value 2.7  [CC1608-0603]  (hidden comment: Res1)
R5  value 60  [CC1608-0603]  (hidden comment: Res1)
R6  value 60  [CC1608-0603]  (hidden comment: Res1)
U3  SN75451BD  [SO-G8/E2.5]
U4  XC3S50-4VQ100C Spartan-3  [F-QFP14X14-G100/N]  (part A of 2)
U5  25LC320/SN  Vendor: Microchip Technology  [SO-G8/E2.9]

### Ports
ADCCS (out), ADCDIN0 (in), ADCDIN1 (in), ADCDIN4 (in), ADCSCLK (out), ADC~{CONVST} (out), FDIN (out), FINIT_B (out), PGARCK (out), PGASERA (out), PGASRCK (out)

### Nets
+5VCC: C8.1 C11.1 R1.2 R2.2 R4.1 U3.1(1A) U3.8(VCC)
GND: C8.2 C9.2 C10.2 C11.2 L1.2 L1.4(C2) O1.3 O1.4 O1.5 O1.8 O2.4(GND) O3.2 O3.4 O3.5 O3.8 U3.4(GND) U3.6(2A) U3.7(2B) U5.4(VSS)
VCC: C9.1 O2.1(OE) O2.8(V+) U5.3(~{WP}) U5.7(~{HOLD}) U5.8(VCC)
FDIN: U4.48(IO_L27N_4/DIN/D0) ; port FDIN
FIBERIN: R3.1 U4.53(IO_L01P_3/VRN_3)
FINIT_B: U4.42(IO_L31N_4/INIT_B) ; port FINIT_B
NetC10_1: C10.1 O3.3 R4.2
NetL1_1: L1.1(A1) R5.2
NetL1_3: L1.3(A2) R6.2
NetO1_1: O1.1 R1.1
NetO1_2: O1.2 R2.1 U3.3(1Y)
NetO2_5: O2.5(OUT) U4.38(IO_L32P_4/GCLK0)
NetO3_1: O3.1 R3.2
NetR5_1: R5.1 U4.28(IO_L01N_5/RDWR_B)
NetR6_1: R6.1 U4.32(IO_L28N_5/D6)
NetU3_2: U3.2(1B) U4.55(IO)
NetU4_1: U4.1(IO_L01P_7/VRN_7) ; port PGASERA
NetU4_2: U4.2(IO_L01N_7/VRP_7) ; port PGASRCK
NetU4_5: U4.5(IO_L21N_7) ; port PGARCK
NetU4_9: U4.9(IO_L23N_7) ; port ADCCS
NetU4_13: U4.13(IO_L40P_6/VREF_6) U5.2(SO)
NetU4_16: U4.16(IO_L24N_6/VREF_6) U5.1(~{CS})
NetU4_22: U4.22(IO_L01P_6/VRN_6) U5.6(SCK)
NetU4_23: U4.23(IO_L01N_6/VRP_6) U5.5(SI)
NetU4_71: U4.71(IO_L21P_2) ; port ADCDIN1
NetU4_72: U4.72(IO_L21N_2) ; port ADCDIN0
NetU4_79: U4.79(IO_L01P_1/VRN_1) ; port ADCDIN4
NetU4_89: U4.89(IO_L32P_0/GCLK6) ; port ADC~{CONVST}
NetU4_91: U4.91(IO_L31P_0/VREF_0) ; port ADCSCLK

Not connected (* = marked no-connect by the designer): U3 5(2Y); U4 4(IO_L21P_7) 8(IO_L23P_7) 11(IO_L40P_7) 12(IO_L40N_7/VREF_7) 14(IO_L40N_6) 15(IO_L24P_6) 17(IO) 21(IO) 27(IO_L01P_5/CS_B) 30(IO_L28P_5/D7) 34(IO_L31P_5/D5) 35(IO_L31N_5/D4) 36(IO_L32P_5/GCLK2) 37(IO_L32N_5/GCLK3) 39(IO_L32N_4/GCLK1) 40(IO_L31P_4/DOUT/BUSY) 43(IO_L30P_4/D3) 44(IO_L30N_4/D2) 47(IO_L27P_4/D1) 49(IO_LO1P_4/VRN_4) 50(IO_L01N_4/VRP_4) 54(IO_L01N_3/VRP_3) 59(IO) 60(IO_L24P_3) 61(IO_L24N_3) 62(IO_L40P_3) 63(IO_L40N_3/VREF_3) 64(IO_L40P_2/VREF_2) 65(IO_L40N_2) 67(IO_L24P_2) 68(IO_L24N_2) 74(IO_L01P_2/VRN_2) 75(IO_L01N_2/VRP_2) 80(IO_L01N_1/VRP_1) 81(IO) 85(IO_L31P_1) 86(IO_L31N_1/VREF_1) 87(IO_L32P_1/GCLK4) 88(IO_L32N_1/GCLK5) 90(IO_L32N_0/GCLK7) 92(IO_L31N_0) 96(IO_L01P_0/VRN_0) 97(IO_L01N_0/VRP_0)

### Library data of the parts
C8-C10 = Cap: as C43 on sheet input; Published: 8-Jun-2000; Revision: July-2002: Re-released for DXP Platform.; Publisher: Altium Limited; Class II: Capacitor
C11 = Cap2: as C33 on sheet PGA; Published: 23-Sep-2002; Publisher: Altium Limited; Class II: Capacitor
O1 = HFBR-1528: Low-cost fiber transmitter; Vendor: Agilent
O2 = SG-636PCE: Epson CMOS/TTL Oscillator; Vendor: Epson Electronics America Inc
O3 = HFBR-2528: Low-cost fiber receiver; Vendor: Agilent
R1-R6 = Res1: as R14 on sheet aafilter; Published: 8-Jun-2000; Revision: July-2002: Re-released for DXP Platform.; Publisher: Altium Limited; Class II: Resistor
U3 = SN75451BD: Dual Peripheral Driver; Manufacturer: Texas Instruments; Package Information: Latest Revision: Jan-1998; Class I: Interface; Published: 15-May-2002; Datasheet: 1991 Interface Circuits Data Book (May-1990); Package Reference: D008; Publisher: Altium Limited; Class II: Peripheral Driver
U4 = XC3S50-4VQ100C: Xilinx Spartan-3 VQ100; Vendor: Xilinx
U5 = 25LC320-SOIC: 32k SPI Bus Serial EEPROM

## Sheet muxes.SCHDOC
size B
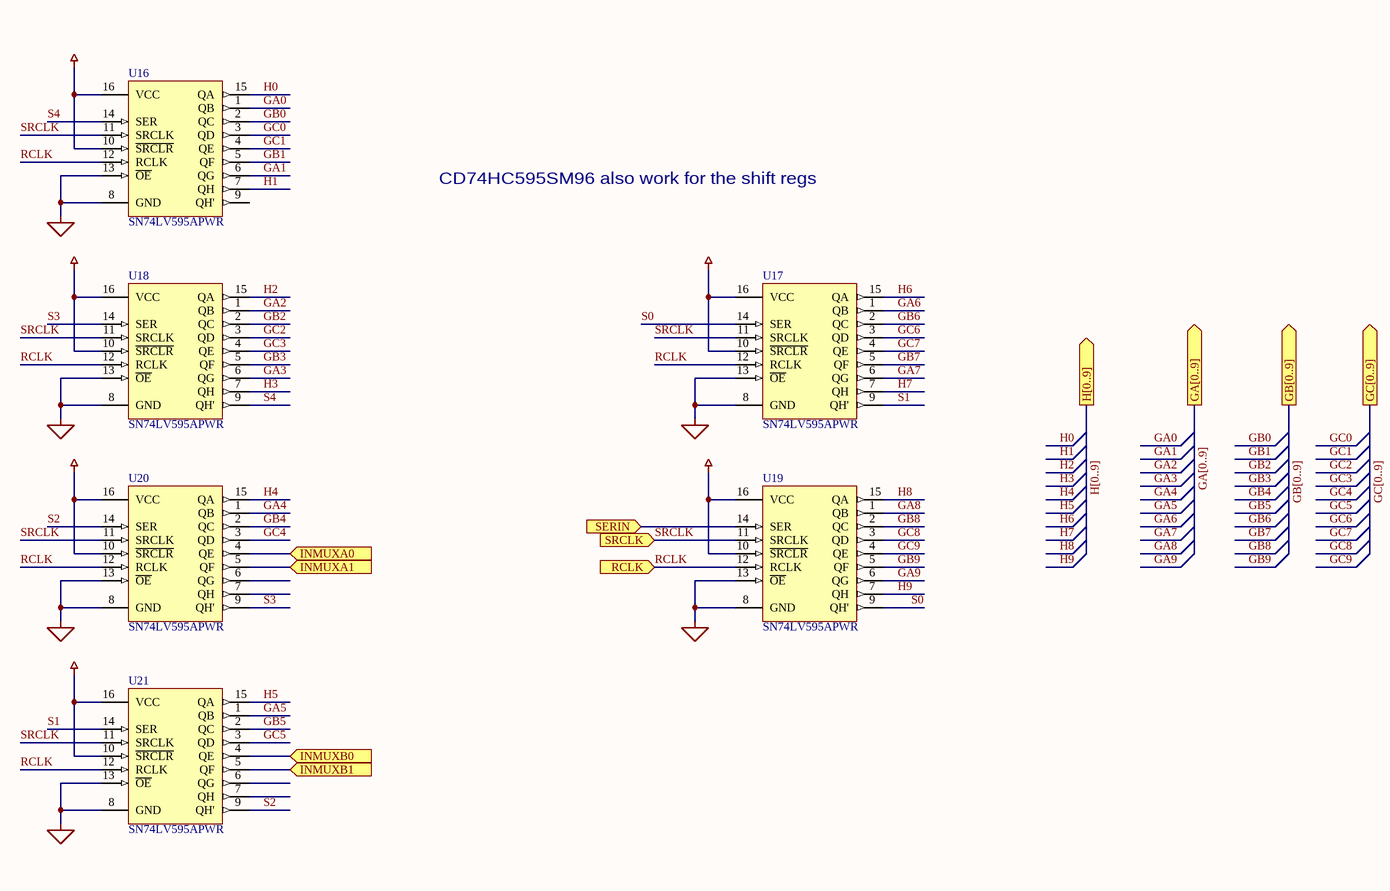
[diagram p8: muxes.SCHDOC]

### Parts
U16  SN74LV595APWR  [SSO-G16/X.4]
U17  SN74LV595APWR  [SSO-G16/X.4]
U18  SN74LV595APWR  [SSO-G16/X.4]
U19  SN74LV595APWR  [SSO-G16/X.4]
U20  SN74LV595APWR  [SSO-G16/X.4]
U21  SN74LV595APWR  [SSO-G16/X.4]

### Ports
GA[0..9] (out), GB[0..9] (out), GC[0..9] (out), H[0..9] (out), INMUXA0 (in), INMUXA1 (in), INMUXB0 (in), INMUXB1 (in), RCLK (in), SERIN (in), SRCLK (in)

### Nets
AGND: U16.8(GND) U16.13(~{OE}) U17.8(GND) U17.13(~{OE}) U18.8(GND) U18.13(~{OE}) U19.8(GND) U19.13(~{OE}) U20.8(GND) U20.13(~{OE}) U21.8(GND) U21.13(~{OE})
AVDD: U16.10(~{SRCLR}) U16.16(VCC) U17.10(~{SRCLR}) U17.16(VCC) U18.10(~{SRCLR}) U18.16(VCC) U19.10(~{SRCLR}) U19.16(VCC) U20.10(~{SRCLR}) U20.16(VCC) U21.10(~{SRCLR}) U21.16(VCC)
GA0: U16.1(QB)
GA1: U16.6(QG)
GA2: U18.1(QB)
GA3: U18.6(QG)
GA4: U20.1(QB)
GA5: U21.1(QB)
GA6: U17.1(QB)
GA7: U17.6(QG)
GA8: U19.1(QB)
GA9: U19.6(QG)  [project net GA10]
GB0: U16.2(QC)
GB1: U16.5(QF)
GB2: U18.2(QC)
GB3: U18.5(QF)
GB4: U20.2(QC)
GB5: U21.2(QC)
GB6: U17.2(QC)
GB7: U17.5(QF)
GB8: U19.2(QC)
GB9: U19.5(QF)  [project net GB10]
GC0: U16.3(QD)
GC1: U16.4(QE)
GC2: U18.3(QD)
GC3: U18.4(QE)
GC4: U20.3(QD)
GC5: U21.3(QD)
GC6: U17.3(QD)
GC7: U17.4(QE)
GC8: U19.3(QD)
GC9: U19.4(QE)  [project net GC10]
H0: U16.15(QA)
H1: U16.7(QH)
H2: U18.15(QA)
H3: U18.7(QH)
H4: U20.15(QA)
H5: U21.15(QA)
H6: U17.15(QA)
H7: U17.7(QH)
H8: U19.15(QA)
H9: U19.7(QH)
RCLK: U16.12(RCLK) U17.12(RCLK) U18.12(RCLK) U19.12(RCLK) U20.12(RCLK) U21.12(RCLK) ; port RCLK
S0: U17.14(SER) U19.9(QH')
S1: U17.9(QH') U21.14(SER)
S2: U20.14(SER) U21.9(QH')
S3: U18.14(SER) U20.9(QH')
S4: U16.14(SER) U18.9(QH')
SRCLK: U16.11(SRCLK) U17.11(SRCLK) U18.11(SRCLK) U19.11(SRCLK) U20.11(SRCLK) U21.11(SRCLK) ; port SRCLK
Netu11_1: U20.4(QE) ; port INMUXA0
Netu11_14: U20.5(QF) ; port INMUXA1
NetU14_11: U19.14(SER) ; port SERIN
NetU21_4: U21.4(QE) ; port INMUXB0
NetU21_5: U21.5(QF) ; port INMUXB1

Not connected (* = marked no-connect by the designer): U16 9(QH'); U20 6(QG) 7(QH); U21 6(QG) 7(QH)

### Buses and harness runs
bus GA[0..9] = port GA[0..9]
bus GB[0..9] = port GB[0..9]
bus GC[0..9] = port GC[0..9]
bus H[0..9] = port H[0..9]

### Notes on the sheet
- CD74HC595SM96 also work for the shift regs

### Library data of the parts
U16-U21 = SN74LV595APWR: 8-bit shift register with 3-state output; Vendor: Texas Instruments

## Sheet FPGA Power.SCHDOC
size A
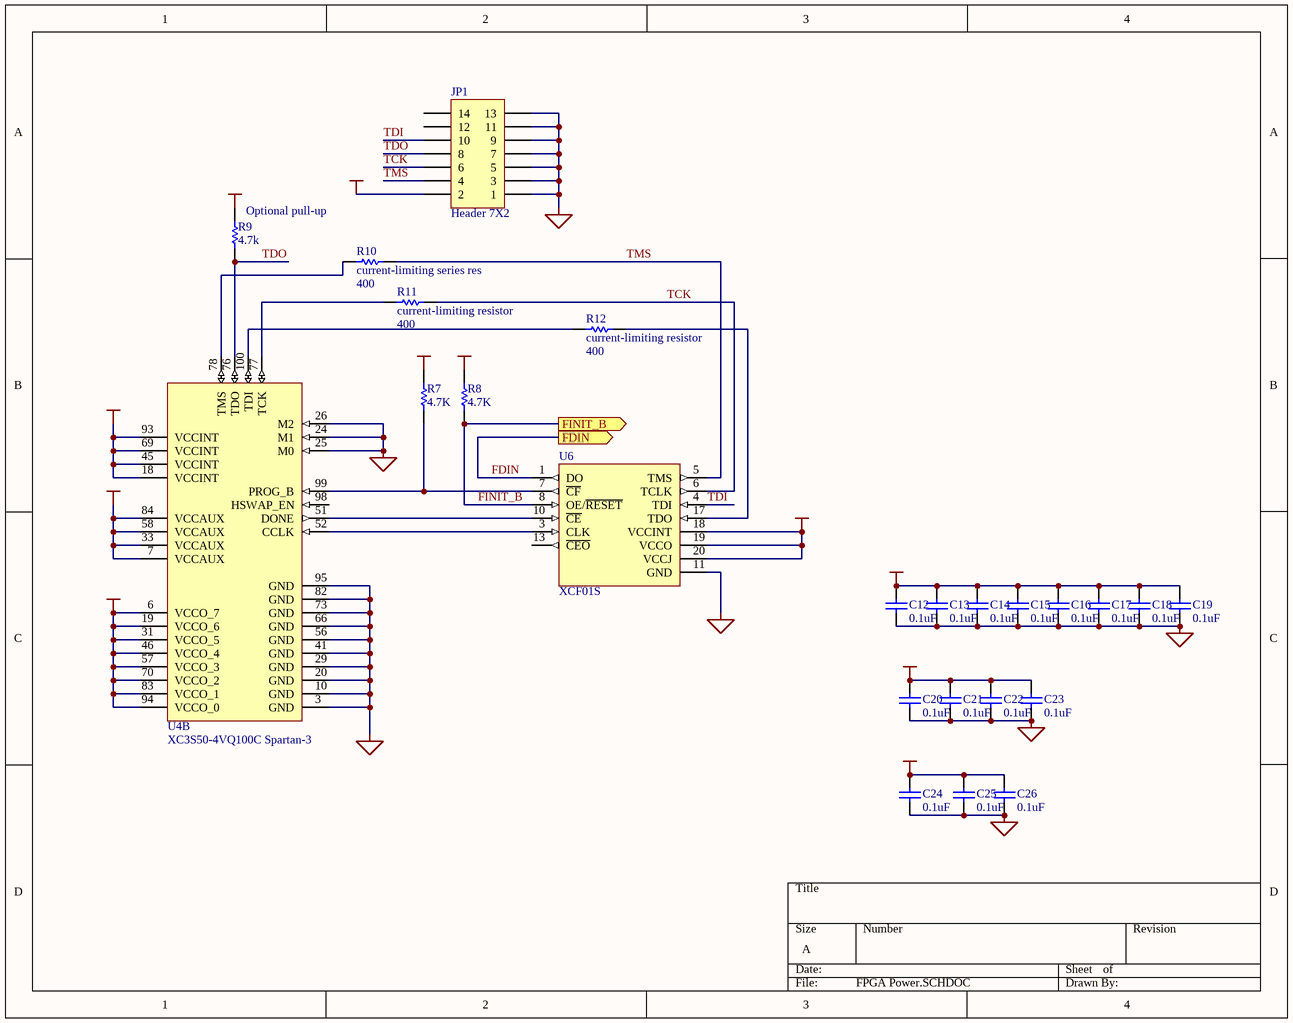
[diagram p9: FPGA Power.SCHDOC]

### Parts
C12  value 0.1uF  [CC1608-0603]  (hidden comment: Cap)
C13  value 0.1uF  [CC1608-0603]  (hidden comment: Cap)
C14  value 0.1uF  [CC1608-0603]  (hidden comment: Cap)
C15  value 0.1uF  [CC1608-0603]  (hidden comment: Cap)
C16  value 0.1uF  [CC1608-0603]  (hidden comment: Cap)
C17  value 0.1uF  [CC1608-0603]  (hidden comment: Cap)
C18  value 0.1uF  [CC1608-0603]  (hidden comment: Cap)
C19  value 0.1uF  [CC1608-0603]  (hidden comment: Cap)
C20  value 0.1uF  [CC1608-0603]  (hidden comment: Cap)
C21  value 0.1uF  [CC1608-0603]  (hidden comment: Cap)
C22  value 0.1uF  [CC1608-0603]  (hidden comment: Cap)
C23  value 0.1uF  [CC1608-0603]  (hidden comment: Cap)
C24  value 0.1uF  [CC1608-0603]  (hidden comment: Cap)
C25  value 0.1uF  [CC1608-0603]  (hidden comment: Cap)
C26  value 0.1uF  [CC1608-0603]  (hidden comment: Cap)
JP1  Header 7X2  [HDR2x7-2mm]
R7  value 4.7K  [CC1608-0603]  (hidden comment: Res1)
R8  value 4.7K  [CC1608-0603]  (hidden comment: Res1)
R9  Optional pull-up  value 4.7k  [CC1608-0603]
R10  current-limiting series res  value 400  [CC1608-0603]
R11  current-limiting resistor  value 400  [CC1608-0603]
R12  current-limiting resistor  value 400  [CC1608-0603]
U4  XC3S50-4VQ100C Spartan-3  [F-QFP14X14-G100/N]  (part B of 2)
U6  XCF01S  [TSSO6x6-G20/X.3]

### Ports
FDIN (out), FINIT_B (out)

### Nets
+1.2VCC: C20.1 C21.1 C22.1 C23.1 U4.18(VCCINT) U4.45(VCCINT) U4.69(VCCINT) U4.93(VCCINT)
+2.5VCC: C24.1 C25.1 C26.1 U4.7(VCCAUX) U4.33(VCCAUX) U4.58(VCCAUX) U4.84(VCCAUX)
GND: C12.2 C13.2 C14.2 C15.2 C16.2 C17.2 C18.2 C19.2 C20.2 C21.2 C22.2 C23.2 C24.2 C25.2 C26.2 JP1.1 JP1.3 JP1.5 JP1.7 JP1.9 JP1.11 JP1.13 U4.3(GND) U4.10(GND) U4.20(GND) U4.24(M1) U4.25(M0) U4.26(M2) U4.29(GND) U4.41(GND) U4.56(GND) U4.66(GND) U4.73(GND) U4.82(GND) U4.95(GND) U6.11(GND)
VCC: C12.1 C13.1 C14.1 C15.1 C16.1 C17.1 C18.1 C19.1 JP1.2 R7.2 R8.2 R9.2 U4.6(VCCO_7) U4.19(VCCO_6) U4.31(VCCO_5) U4.46(VCCO_4) U4.57(VCCO_3) U4.70(VCCO_2) U4.83(VCCO_1) U4.94(VCCO_0) U6.18(VCCINT) U6.19(VCCO) U6.20(VCCJ)
FDIN: U6.1(DO) ; port FDIN
FINIT_B: R8.1 U6.8(OE/~{RESET}) ; port FINIT_B
TCK: JP1.6 R11.1 U6.6(TCLK)
TDI: JP1.10 U6.4(TDI)
TDO: JP1.8 R9.1 U4.76(TDO)
TMS: JP1.4 R10.1 U6.5(TMS)
NetR7_1: R7.1 U4.99(PROG_B) U6.7(~{CF})
NetR10_2: R10.2 U4.78(TMS)
NetR11_2: R11.2 U4.77(TCK)
NetR12_1: R12.1 U6.17(TDO)
NetR12_2: R12.2 U4.100(TDI)
NetU4_51: U4.51(DONE) U6.10(~{CE})
NetU4_52: U4.52(CCLK) U6.3(CLK)

Not connected (* = marked no-connect by the designer): JP1 12 14; U4 98(HSWAP_EN); U6 13(~{CEO})

### Library data of the parts
C12-C26 = Cap: as C43 on sheet input; Published: 8-Jun-2000; Revision: July-2002: Re-released for DXP Platform.; Publisher: Altium Limited; Class II: Capacitor
JP1 = Header 7X2: Header, 7-Pin, Dual row; Manufacturer: Generic Components; Class I: Connector; Revision: July-2002: Re-released for DXP Platform.; Publisher: Altium Limited
R7-R12 = Res1: as R14 on sheet aafilter; Published: 8-Jun-2000; Revision: July-2002: Re-released for DXP Platform.; Publisher: Altium Limited; Class II: Resistor
U4 = XC3S50-4VQ100C: Xilinx Spartan-3 VQ100; Vendor: Xilinx
U6 = XCF01S: Xilinx Platform Flash; Vendor: Xilinx

## Sheet ADC.SCHDOC
size B
Used 10 times, as channels ADC1, ADC2, ADC3, ADC4, ADC5, ADC6, ADC7, ADC8, ADC9, ADC10. Parts and nets are listed once, with the designators drawn on the sheet.
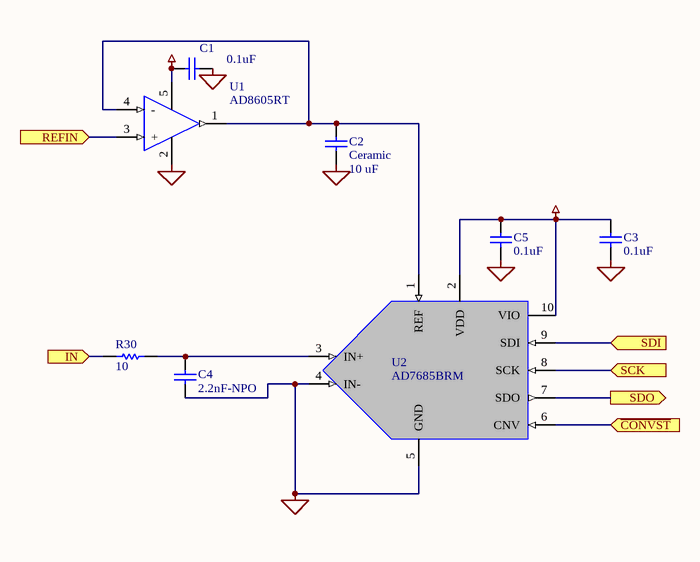
[diagram p10: ADC.SCHDOC]

### Parts
C1  value 0.1uF  [CC1608-0603]  (hidden comment: Cap)
C2  Ceramic  value 10 uF  [0805]
C3  value 0.1uF  [CC1608-0603]  (hidden comment: Cap)
C4  value 2.2nF-NPO  [0603]  (hidden comment: Cap)
C5  value 0.1uF  [CC1608-0603]  (hidden comment: Cap)
R30  value 10  [0603]  (hidden comment: Res1)
U1  AD8605RT  [SO-G5/P.95]
U2  AD7685BRM  [AD RM-10]

### Ports
IN (in), REFIN (in), SCK (in), SDI (in), SDO (out), ~{CONVST} (in)

### Nets
AGND: C1.2 C2.1 C3.1 C4.1 C5.1 U1.2(-Vs) U2.4(IN-) U2.5(GND)
AVDD: C1.1 C3.2 C5.2 U1.5(+Vs) U2.2(VDD) U2.10(VIO)
~{CONVST}: U2.6(CNV) ; port ~{CONVST}
IN: R30.1 ; port IN
REFIN: U1.3(+) ; port REFIN
SCK: U2.8(SCK) ; port SCK
SDI: U2.9(SDI) ; port SDI
SDO: U2.7(SDO) ; port SDO
NetC2_2: C2.2 U1.1(Out) U1.4(-) U2.1(REF)
NetC4_2: C4.2 R30.2 U2.3(IN+)

### Channels
ADC1: designators end in .1; ports IN=AAOUT1 REFIN=REF SCK=SCK SDI=SDI1 SDO=SDO1 ~{CONVST}=~{CONVST}
ADC2: designators end in .2; ports IN=AAOUT2 REFIN=REF SCK=SCK SDI=SDI2 SDO=SDO2 ~{CONVST}=~{CONVST}
ADC3: designators end in .3; ports IN=AAOUT3 REFIN=REF SCK=SCK SDI=SDI3 SDO=SDO3 ~{CONVST}=~{CONVST}
ADC4: designators end in .4; ports IN=AAOUT4 REFIN=REF SCK=SCK SDI=SDI4 SDO=SDO4 ~{CONVST}=~{CONVST}
ADC5: designators end in .5; ports IN=AAOUT5 REFIN=REF SCK=SCK SDI=SDI5 SDO=SDO5 ~{CONVST}=~{CONVST}
ADC6: designators end in .6; ports IN=AAOUT6 REFIN=REF SCK=SCK SDI=SDI6 SDO=SDO6 ~{CONVST}=~{CONVST}
ADC7: designators end in .7; ports IN=AAOUT7 REFIN=REF SCK=SCK SDI=SDI7 SDO=SDO7 ~{CONVST}=~{CONVST}
ADC8: designators end in .8; ports IN=AAOUT8 REFIN=REF SCK=SCK SDI=SDI8 SDO=SDO8 ~{CONVST}=~{CONVST}
ADC9: designators end in .9; ports IN=AAOUT9 REFIN=REF SCK=SCK SDI=SDI9 SDO=SDO9 ~{CONVST}=~{CONVST}
ADC10: designators end in .10; ports IN=AAOUT10 REFIN=REF SCK=SCK SDI=SDI10 SDO=SDO10 ~{CONVST}=~{CONVST}

### Library data of the parts
C1 C3 C5 = Cap: as C43 on sheet input; Published: 8-Jun-2000; Revision: July-2002: Re-released for DXP Platform.; Publisher: Altium Limited; Class II: Capacitor
C2 C4 = Cap: Capacitor; Published: 8-Jun-2000; LatestRevisionDate: 17-Jul-2002; LatestRevisionNote: Re-released for DXP Platform.; Publisher: Altium Limited
R30 = Res1: Resistor; Published: 8-Jun-2000; LatestRevisionDate: 17-Jul-2002; LatestRevisionNote: Re-released for DXP Platform.; Publisher: Altium Limited
U1 = AD8605RT: Analog Devices Precision Low Noise CMOS Rail-to-Rail Input/Output Operational Amplifier
U2 = AD7685: AD 16-bit 250 kSPS ADC; Vendor: Analog Devices

## Nets that join several sheets
+1.2VCC: power (C68.1 U22.12 U22.13 U22.14), FPGA Power (8 pins)
+2.5VCC: power (C62.1 U23.5 U23.6), FPGA Power (7 pins)
+5VCC: power (9 pins), FPGA (7 pins)
AGND: main (6 pins), IN1 (5 pins), IN2 (5 pins), IN3 (5 pins), IN4 (5 pins), IN5 (5 pins), IN6 (5 pins), IN7 (5 pins), IN8 (5 pins), AA1 (9 pins), AA2 (9 pins), AA3 (9 pins), AA4 (9 pins), AA5 (9 pins), AA6 (9 pins), AA7 (9 pins), AA8 (9 pins), AA9 (9 pins), AA10 (9 pins), inmux (u11.13 u27.13), PGA1 (9 pins), PGA2 (9 pins), PGA3 (9 pins), PGA4 (9 pins), PGA5 (9 pins), PGA6 (9 pins), PGA7 (9 pins), PGA8 (9 pins), PGA9 (9 pins), PGA10 (9 pins), isolation (7 pins), power (21 pins), muxes (12 pins), ADC1 (8 pins), ADC2 (8 pins), ADC3 (8 pins), ADC4 (8 pins), ADC5 (8 pins), ADC6 (8 pins), ADC7 (8 pins), ADC8 (8 pins), ADC9 (8 pins), ADC10 (8 pins)
AVDD: IN1 (C43.1.1 C45.1.1 U12.1.8), IN2 (C43.2.1 C45.2.1 U12.2.8), IN3 (C43.3.1 C45.3.1 U12.3.8), IN4 (C43.4.1 C45.4.1 U12.4.8), IN5 (C43.5.1 C45.5.1 U12.5.8), IN6 (C43.6.1 C45.6.1 U12.6.8), IN7 (C43.7.1 C45.7.1 U12.7.8), IN8 (C43.8.1 C45.8.1 U12.8.8), AA1 (C71.1.2 U10.1.4), AA2 (C71.2.2 U10.2.4), AA3 (C71.3.2 U10.3.4), AA4 (C71.4.2 U10.4.4), AA5 (C71.5.2 U10.5.4), AA6 (C71.6.2 U10.6.4), AA7 (C71.7.2 U10.7.4), AA8 (C71.8.2 U10.8.4), AA9 (C71.9.2 U10.9.4), AA10 (C71.10.2 U10.10.4), inmux (u11.2 u11.12 u27.2 u27.12), PGA1 (6 pins), PGA2 (6 pins), PGA3 (6 pins), PGA4 (6 pins), PGA5 (6 pins), PGA6 (6 pins), PGA7 (6 pins), PGA8 (6 pins), PGA9 (6 pins), PGA10 (6 pins), isolation (R35.2 R39.2), power (8 pins), muxes (12 pins), ADC1 (6 pins), ADC2 (6 pins), ADC3 (6 pins), ADC4 (6 pins), ADC5 (6 pins), ADC6 (6 pins), ADC7 (6 pins), ADC8 (6 pins), ADC9 (6 pins), ADC10 (6 pins)
AVSS: IN1 (C44.1.1 C46.1.2 U12.1.5), IN2 (C44.2.1 C46.2.2 U12.2.5), IN3 (C44.3.1 C46.3.2 U12.3.5), IN4 (C44.4.1 C46.4.2 U12.4.5), IN5 (C44.5.1 C46.5.2 U12.5.5), IN6 (C44.6.1 C46.6.2 U12.6.5), IN7 (C44.7.1 C46.7.2 U12.7.5), IN8 (C44.8.1 C46.8.2 U12.8.5), AA1 (C72.1.1 U10.1.11), AA2 (C72.2.1 U10.2.11), AA3 (C72.3.1 U10.3.11), AA4 (C72.4.1 U10.4.11), AA5 (C72.5.1 U10.5.11), AA6 (C72.6.1 U10.6.11), AA7 (C72.7.1 U10.7.11), AA8 (C72.8.1 U10.8.11), AA9 (C72.9.1 U10.9.11), AA10 (C72.10.1 U10.10.11), inmux (u11.3 u27.3), PGA1 (6 pins), PGA2 (6 pins), PGA3 (6 pins), PGA4 (6 pins), PGA5 (6 pins), PGA6 (6 pins), PGA7 (6 pins), PGA8 (6 pins), PGA9 (6 pins), PGA10 (6 pins), power (C59.2 C70.2 L3.2 U26.4)
GND: isolation (6 pins), power (31 pins), FPGA (19 pins), FPGA Power (36 pins)
VCC: isolation (C50.2 C52.2 U14.1 U15.16), power (C67.1 U22.17 U22.18 U22.19), FPGA (6 pins), FPGA Power (23 pins)
AAIN1: AA1 (R16.1.1), PGA1 (U8.1.1)
AAIN2: AA2 (R16.2.1), PGA2 (U8.2.1)
AAIN3: AA3 (R16.3.1), PGA3 (U8.3.1)
AAIN4: AA4 (R16.4.1), PGA4 (U8.4.1)
AAIN5: AA5 (R16.5.1), PGA5 (U8.5.1)
AAIN6: AA6 (R16.6.1), PGA6 (U8.6.1)
AAIN7: AA7 (R16.7.1), PGA7 (U8.7.1)
AAIN8: AA8 (R16.8.1), PGA8 (U8.8.1)
AAIN9: AA9 (R16.9.1), PGA9 (U8.9.1)
AAIN10: AA10 (R16.10.1), PGA10 (U8.10.1)
AAOUT1: AA1 (C40.1.1 R21.1.1 U10.1.7), ADC1 (R30.1.1)
AAOUT2: AA2 (C40.2.1 R21.2.1 U10.2.7), ADC2 (R30.2.1)
AAOUT3: AA3 (C40.3.1 R21.3.1 U10.3.7), ADC3 (R30.3.1)
AAOUT4: AA4 (C40.4.1 R21.4.1 U10.4.7), ADC4 (R30.4.1)
AAOUT5: AA5 (C40.5.1 R21.5.1 U10.5.7), ADC5 (R30.5.1)
AAOUT6: AA6 (C40.6.1 R21.6.1 U10.6.7), ADC6 (R30.6.1)
AAOUT7: AA7 (C40.7.1 R21.7.1 U10.7.7), ADC7 (R30.7.1)
AAOUT8: AA8 (C40.8.1 R21.8.1 U10.8.7), ADC8 (R30.8.1)
AAOUT9: AA9 (C40.9.1 R21.9.1 U10.9.7), ADC9 (R30.9.1)
AAOUT10: AA10 (C40.10.1 R21.10.1 U10.10.7), ADC10 (R30.10.1)
~{CONVST}: isolation (R40.1), ADC1 (U2.1.6), ADC2 (U2.2.6), ADC3 (U2.3.6), ADC4 (U2.4.6), ADC5 (U2.5.6), ADC6 (U2.6.6), ADC7 (U2.7.6), ADC8 (U2.8.6), ADC9 (U2.9.6), ADC10 (U2.10.6)
FDIN: FPGA (U4.48), FPGA Power (U6.1)
FINIT_B: FPGA (U4.42), FPGA Power (R8.1 U6.8)
GA0: PGA1 (U8.1.5), muxes (U16.1)
GA1: PGA2 (U8.2.5), muxes (U16.6)
GA2: PGA3 (U8.3.5), muxes (U18.1)
GA3: PGA4 (U8.4.5), muxes (U18.6)
GA4: PGA5 (U8.5.5), muxes (U20.1)
GA5: PGA6 (U8.6.5), muxes (U21.1)
GA6: PGA7 (U8.7.5), muxes (U17.1)
GA7: PGA8 (U8.8.5), muxes (U17.6)
GA8: PGA9 (U8.9.5), muxes (U19.1)
GA10: PGA10 (U8.10.5), muxes (U19.6)
GB0: PGA1 (U8.1.6), muxes (U16.2)
GB1: PGA2 (U8.2.6), muxes (U16.5)
GB2: PGA3 (U8.3.6), muxes (U18.2)
GB3: PGA4 (U8.4.6), muxes (U18.5)
GB4: PGA5 (U8.5.6), muxes (U20.2)
GB5: PGA6 (U8.6.6), muxes (U21.2)
GB6: PGA7 (U8.7.6), muxes (U17.2)
GB7: PGA8 (U8.8.6), muxes (U17.5)
GB8: PGA9 (U8.9.6), muxes (U19.2)
GB10: PGA10 (U8.10.6), muxes (U19.5)
GC0: PGA1 (U8.1.7), muxes (U16.3)
GC1: PGA2 (U8.2.7), muxes (U16.4)
GC2: PGA3 (U8.3.7), muxes (U18.3)
GC3: PGA4 (U8.4.7), muxes (U18.4)
GC4: PGA5 (U8.5.7), muxes (U20.3)
GC5: PGA6 (U8.6.7), muxes (U21.3)
GC6: PGA7 (U8.7.7), muxes (U17.3)
GC7: PGA8 (U8.8.7), muxes (U17.4)
GC8: PGA9 (U8.9.7), muxes (U19.3)
GC10: PGA10 (U8.10.7), muxes (U19.4)
H0: PGA1 (U9.1.6), muxes (U16.15)
H1: PGA2 (U9.2.6), muxes (U16.7)
H2: PGA3 (U9.3.6), muxes (U18.15)
H3: PGA4 (U9.4.6), muxes (U18.7)
H4: PGA5 (U9.5.6), muxes (U20.15)
H5: PGA6 (U9.6.6), muxes (U21.15)
H6: PGA7 (U9.7.6), muxes (U17.15)
H7: PGA8 (U9.8.6), muxes (U17.7)
H8: PGA9 (U9.9.6), muxes (U19.15)
H9: PGA10 (U9.10.6), muxes (U19.7)
IN+1: main (JP2.4), IN1 (U12.1.1)
IN+2: main (JP2.6), IN2 (U12.2.1)
IN+3: main (JP2.8), IN3 (U12.3.1)
IN+4: main (JP2.10), IN4 (U12.4.1)
IN+5: main (JP2.12), IN5 (U12.5.1)
IN+6: main (JP2.14), IN6 (U12.6.1)
IN+7: main (JP2.16), IN7 (U12.7.1)
IN+8: main (JP2.18), IN8 (U12.8.1)
IN-1: main (JP2.3), IN1 (U12.1.4)
IN-2: main (JP2.5), IN2 (U12.2.4)
IN-3: main (JP2.7), IN3 (U12.3.4)
IN-4: main (JP2.9), IN4 (U12.4.4)
IN-5: main (JP2.11), IN5 (U12.5.4)
IN-6: main (JP2.13), IN6 (U12.6.4)
IN-7: main (JP2.15), IN7 (U12.7.4)
IN-8: main (JP2.17), IN8 (U12.8.4)
INAOUT1: IN1 (U12.1.7), inmux (u11.4), PGA1 (C30.1.2 U9.1.8)
INAOUT2: IN2 (U12.2.7), inmux (u11.5), PGA2 (C30.2.2 U9.2.8)
INAOUT3: IN3 (U12.3.7), inmux (u11.11), PGA3 (C30.3.2 U9.3.8)
INAOUT4: IN4 (U12.4.7), inmux (u11.10), PGA4 (C30.4.2 U9.4.8)
INAOUT5: IN5 (U12.5.7), inmux (u27.11), PGA7 (C30.7.2 U9.7.8)
INAOUT6: IN6 (U12.6.7), inmux (u27.10), PGA8 (C30.8.2 U9.8.8)
INAOUT7: IN7 (U12.7.7), inmux (u27.5), PGA9 (C30.9.2 U9.9.8)
INAOUT8: IN8 (U12.8.7), inmux (u27.4), PGA10 (C30.10.2 U9.10.8)
NetU4_1: isolation (U14.6), FPGA (U4.1)
NetU4_2: isolation (U14.5), FPGA (U4.2)
NetU4_5: isolation (U14.4), FPGA (U4.5)
NetU4_9: isolation (U14.3), FPGA (U4.9)
NetU4_71: isolation (U15.14), FPGA (U4.71)
NetU4_72: isolation (U15.13), FPGA (U4.72)
NetU4_89: isolation (U15.12), FPGA (U4.89)
NetU4_91: isolation (U15.11), FPGA (U4.91)
NetU10.1_5: AA1 (U10.1.5), AA2 (U10.2.5), AA3 (U10.3.5), AA4 (U10.4.5), AA5 (U10.5.5), AA6 (U10.6.5), AA7 (U10.7.5), AA8 (U10.8.5), AA9 (U10.9.5), AA10 (U10.10.5), power (U26.2 U26.6)
Netu11_1: inmux (u11.1), muxes (U20.4)
Netu11_14: inmux (u11.14), muxes (U20.5)
NetU14_11: isolation (U14.11), muxes (U19.14)
NetU21_4: inmux (u27.1), muxes (U21.4)
NetU21_5: inmux (u27.14), muxes (U21.5)
PGAIN5: inmux (u11.6), PGA5 (C30.5.2 U9.5.8)
PGAIN6: inmux (u27.6), PGA6 (C30.6.2 U9.6.8)
RCLK: isolation (U14.13), muxes (6 pins)
REF: power (C64.1 C66.1 U25.6 U25.7), ADC1 (U1.1.3), ADC2 (U1.2.3), ADC3 (U1.3.3), ADC4 (U1.4.3), ADC5 (U1.5.3), ADC6 (U1.6.3), ADC7 (U1.7.3), ADC8 (U1.8.3), ADC9 (U1.9.3), ADC10 (U1.10.3)
SCK: isolation (R41.1), ADC1 (U2.1.8), ADC2 (U2.2.8), ADC3 (U2.3.8), ADC4 (U2.4.8), ADC5 (U2.5.8), ADC6 (U2.6.8), ADC7 (U2.7.8), ADC8 (U2.8.8), ADC9 (U2.9.8), ADC10 (U2.10.8)
SDI1: main (R46.2), ADC1 (U2.1.9)
SDI2: main (R44.2), ADC2 (U2.2.9)
SDI3: main (R43.2), ADC3 (U2.3.9)
SDI4: main (R37.2), ADC4 (U2.4.9)
SDI5: main (R36.2), ADC5 (U2.5.9)
SDI6: main (R45.2), ADC6 (U2.6.9)
SDI7: main (R34.2), ADC7 (U2.7.9)
SDI8: main (R33.2), ADC8 (U2.8.9)
SDI9: main (R32.2), ADC9 (U2.9.9)
SDI10: main (R31.2), ADC10 (U2.10.9)
SDO1: main (R44.1), ADC1 (U2.1.7)
SDO2: main (R43.1), ADC2 (U2.2.7)
SDO3: main (R37.1), ADC3 (U2.3.7)
SDO4: main (R36.1), ADC4 (U2.4.7)
SDO5: isolation (R38.2 U15.3), ADC5 (U2.5.7)
SDO6: main (R34.1), ADC6 (U2.6.7)
SDO7: main (R33.1), ADC7 (U2.7.7)
SDO8: main (R32.1), ADC8 (U2.8.7)
SDO9: main (R31.1), ADC9 (U2.9.7)
SDO10: isolation (U15.4), ADC10 (U2.10.7)
SRCLK: isolation (U14.12), muxes (6 pins)